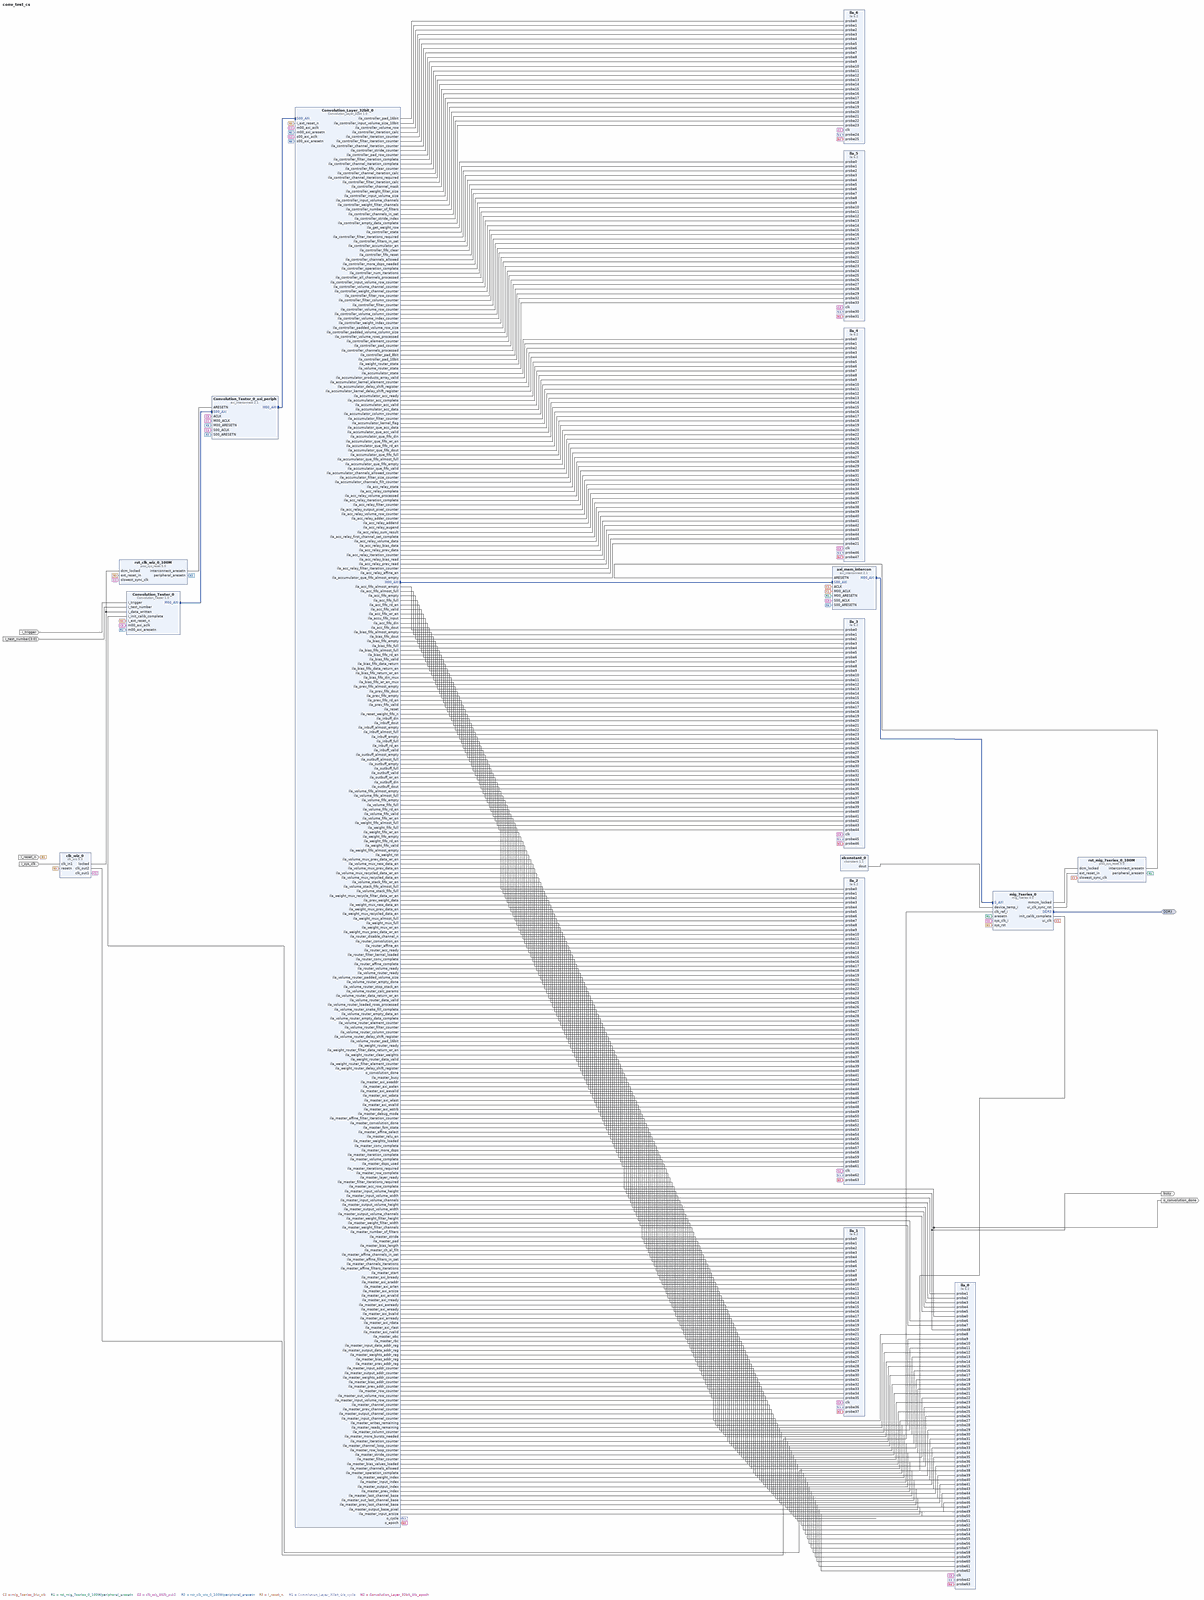
[diagram p0: block diagram of the top level, whole]
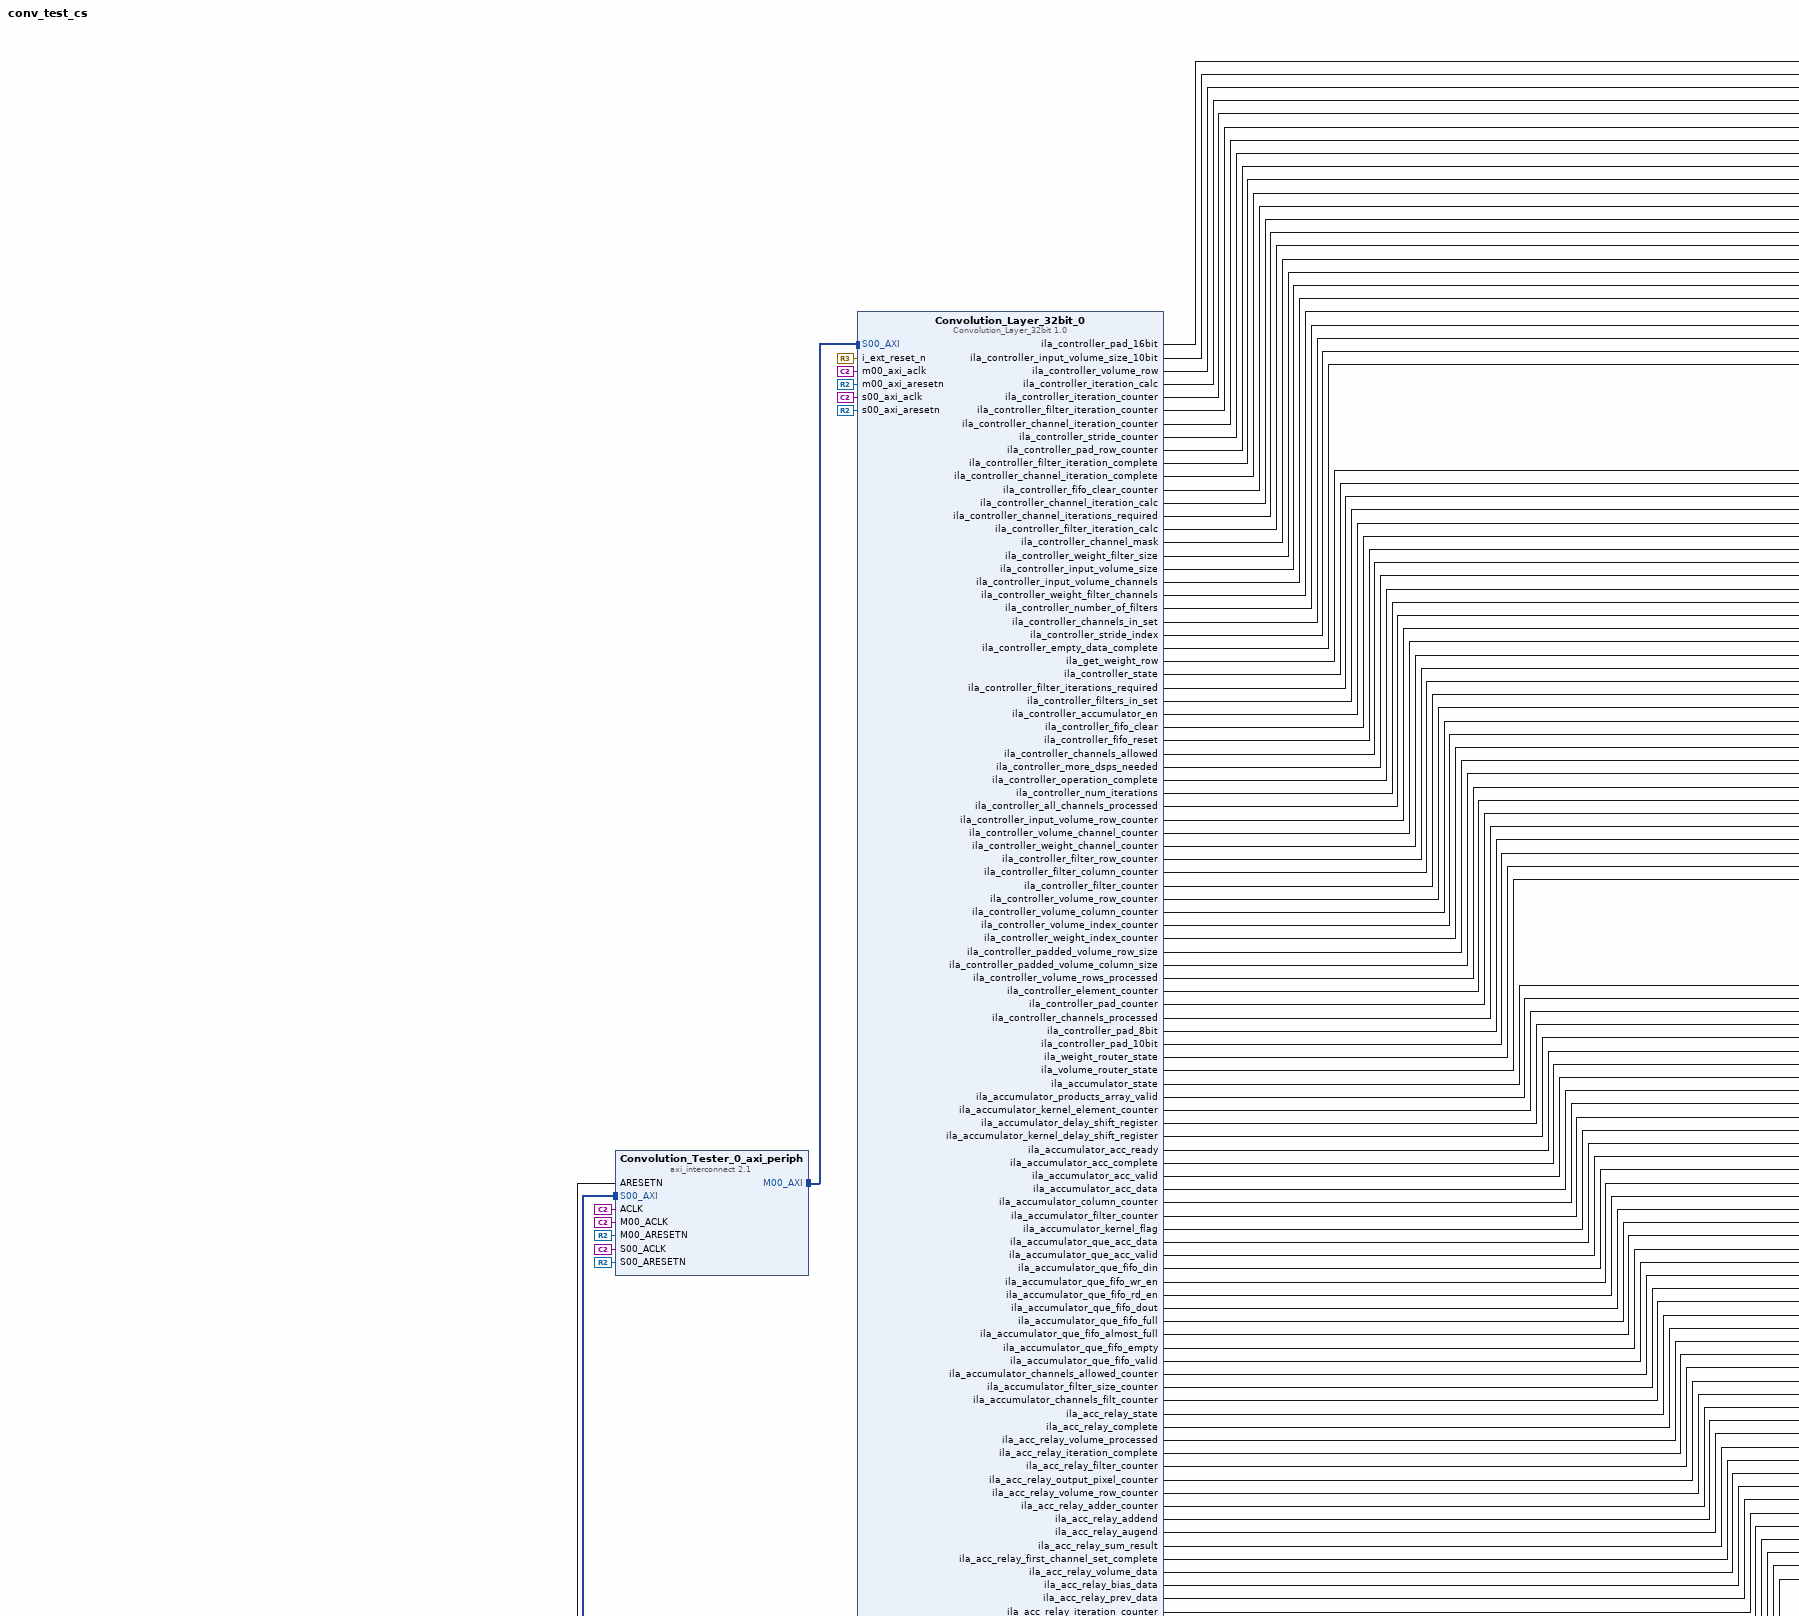
[diagram p1: block diagram of the top level, upper left part]
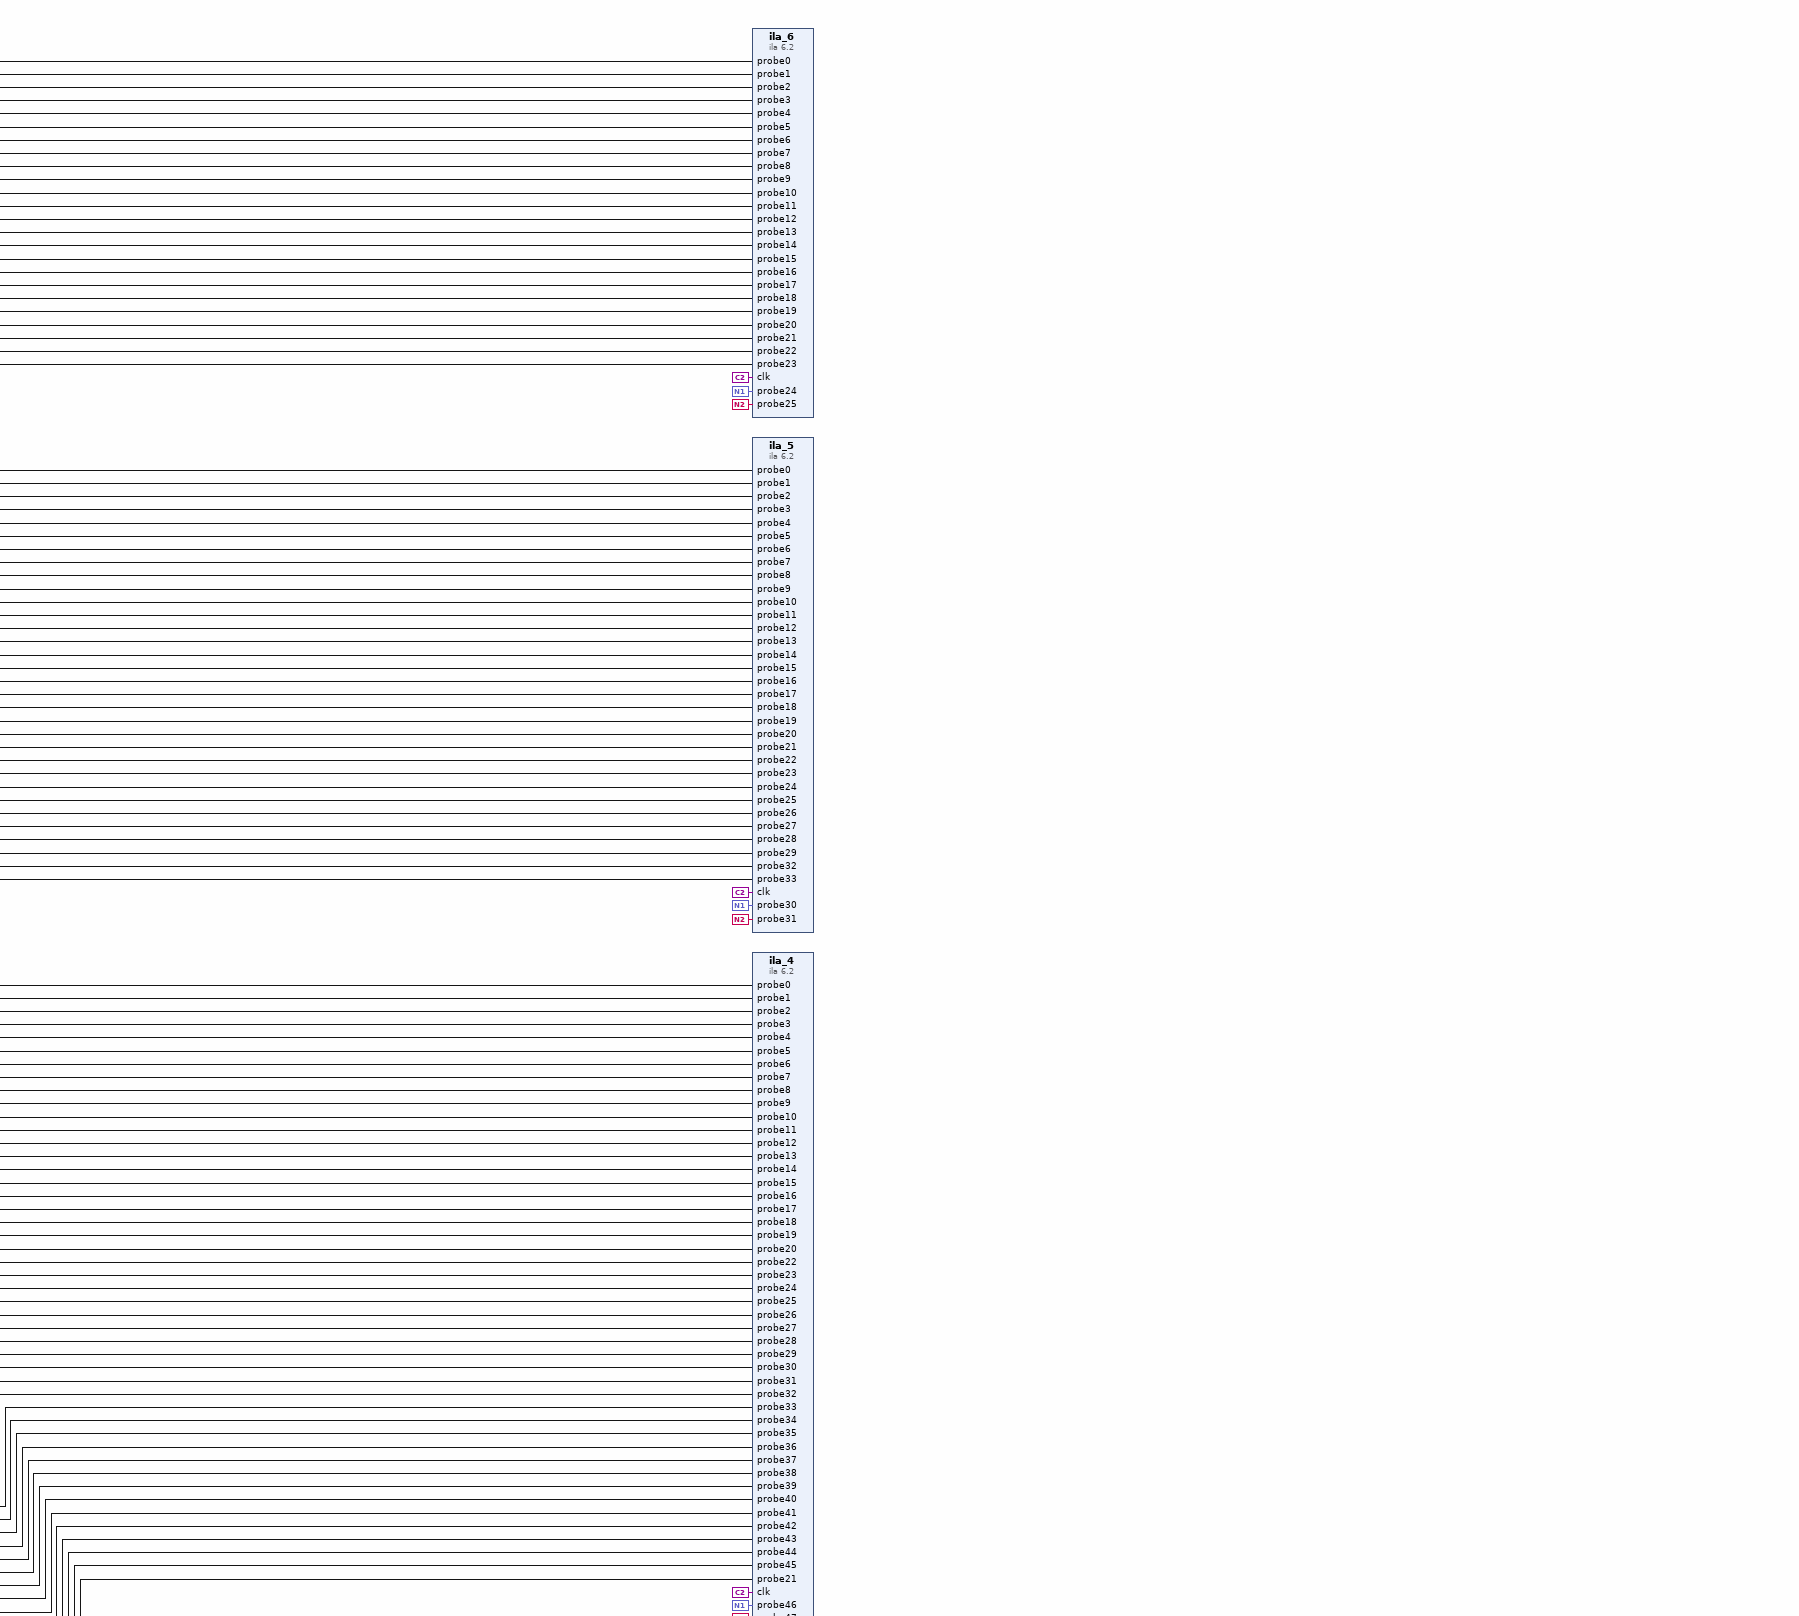
[diagram p2: block diagram of the top level, upper right part]
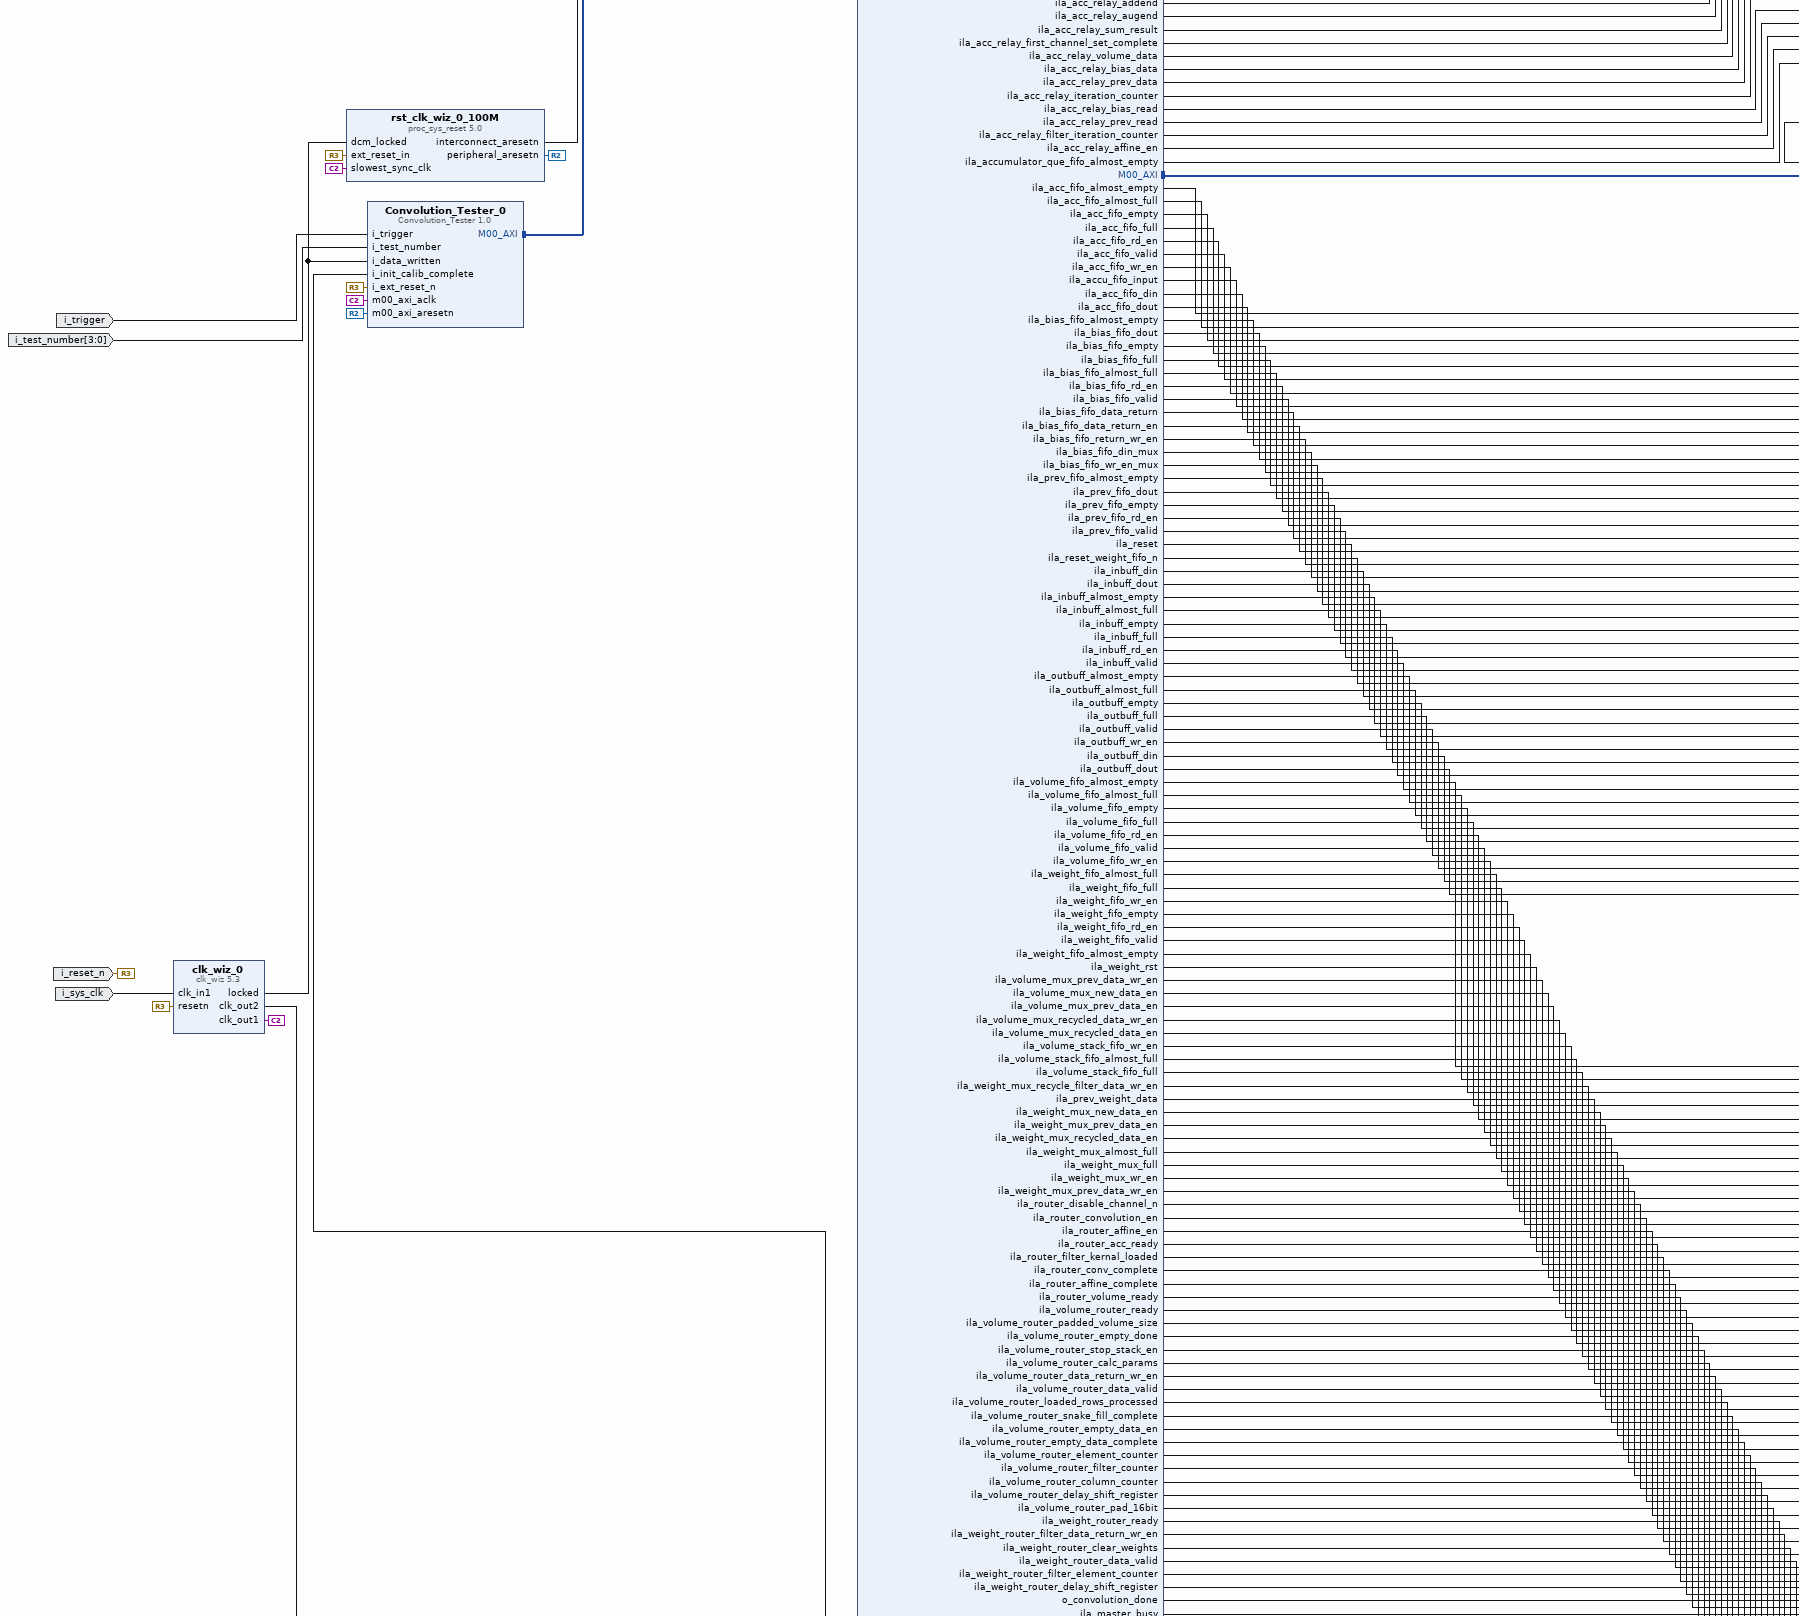
[diagram p3: block diagram of the top level, middle left part]
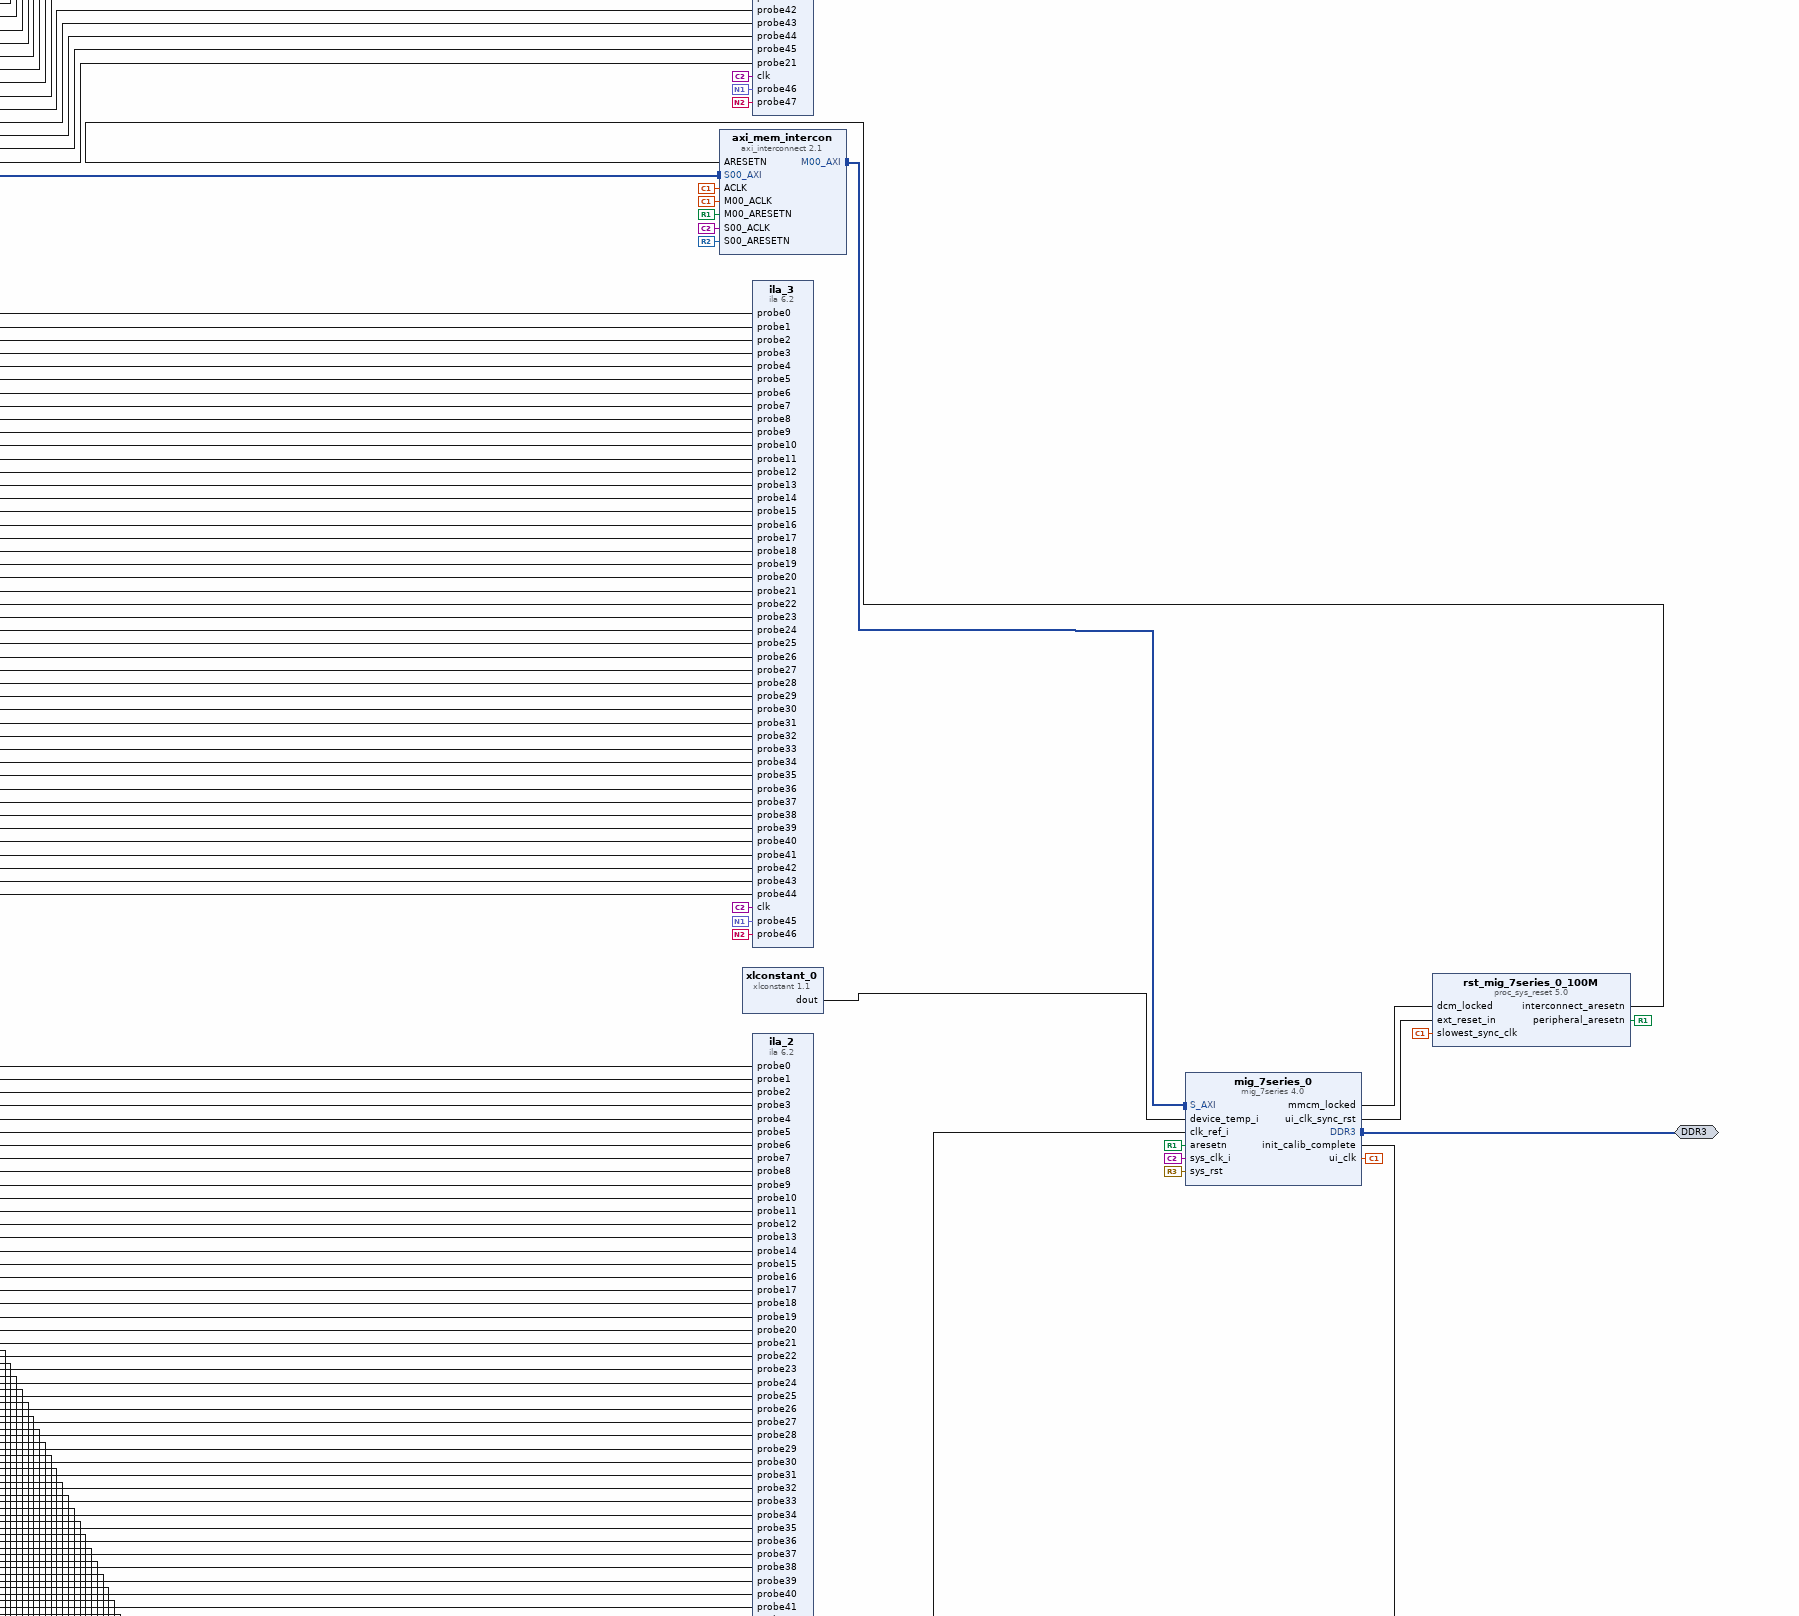
[diagram p4: block diagram of the top level, middle right part]
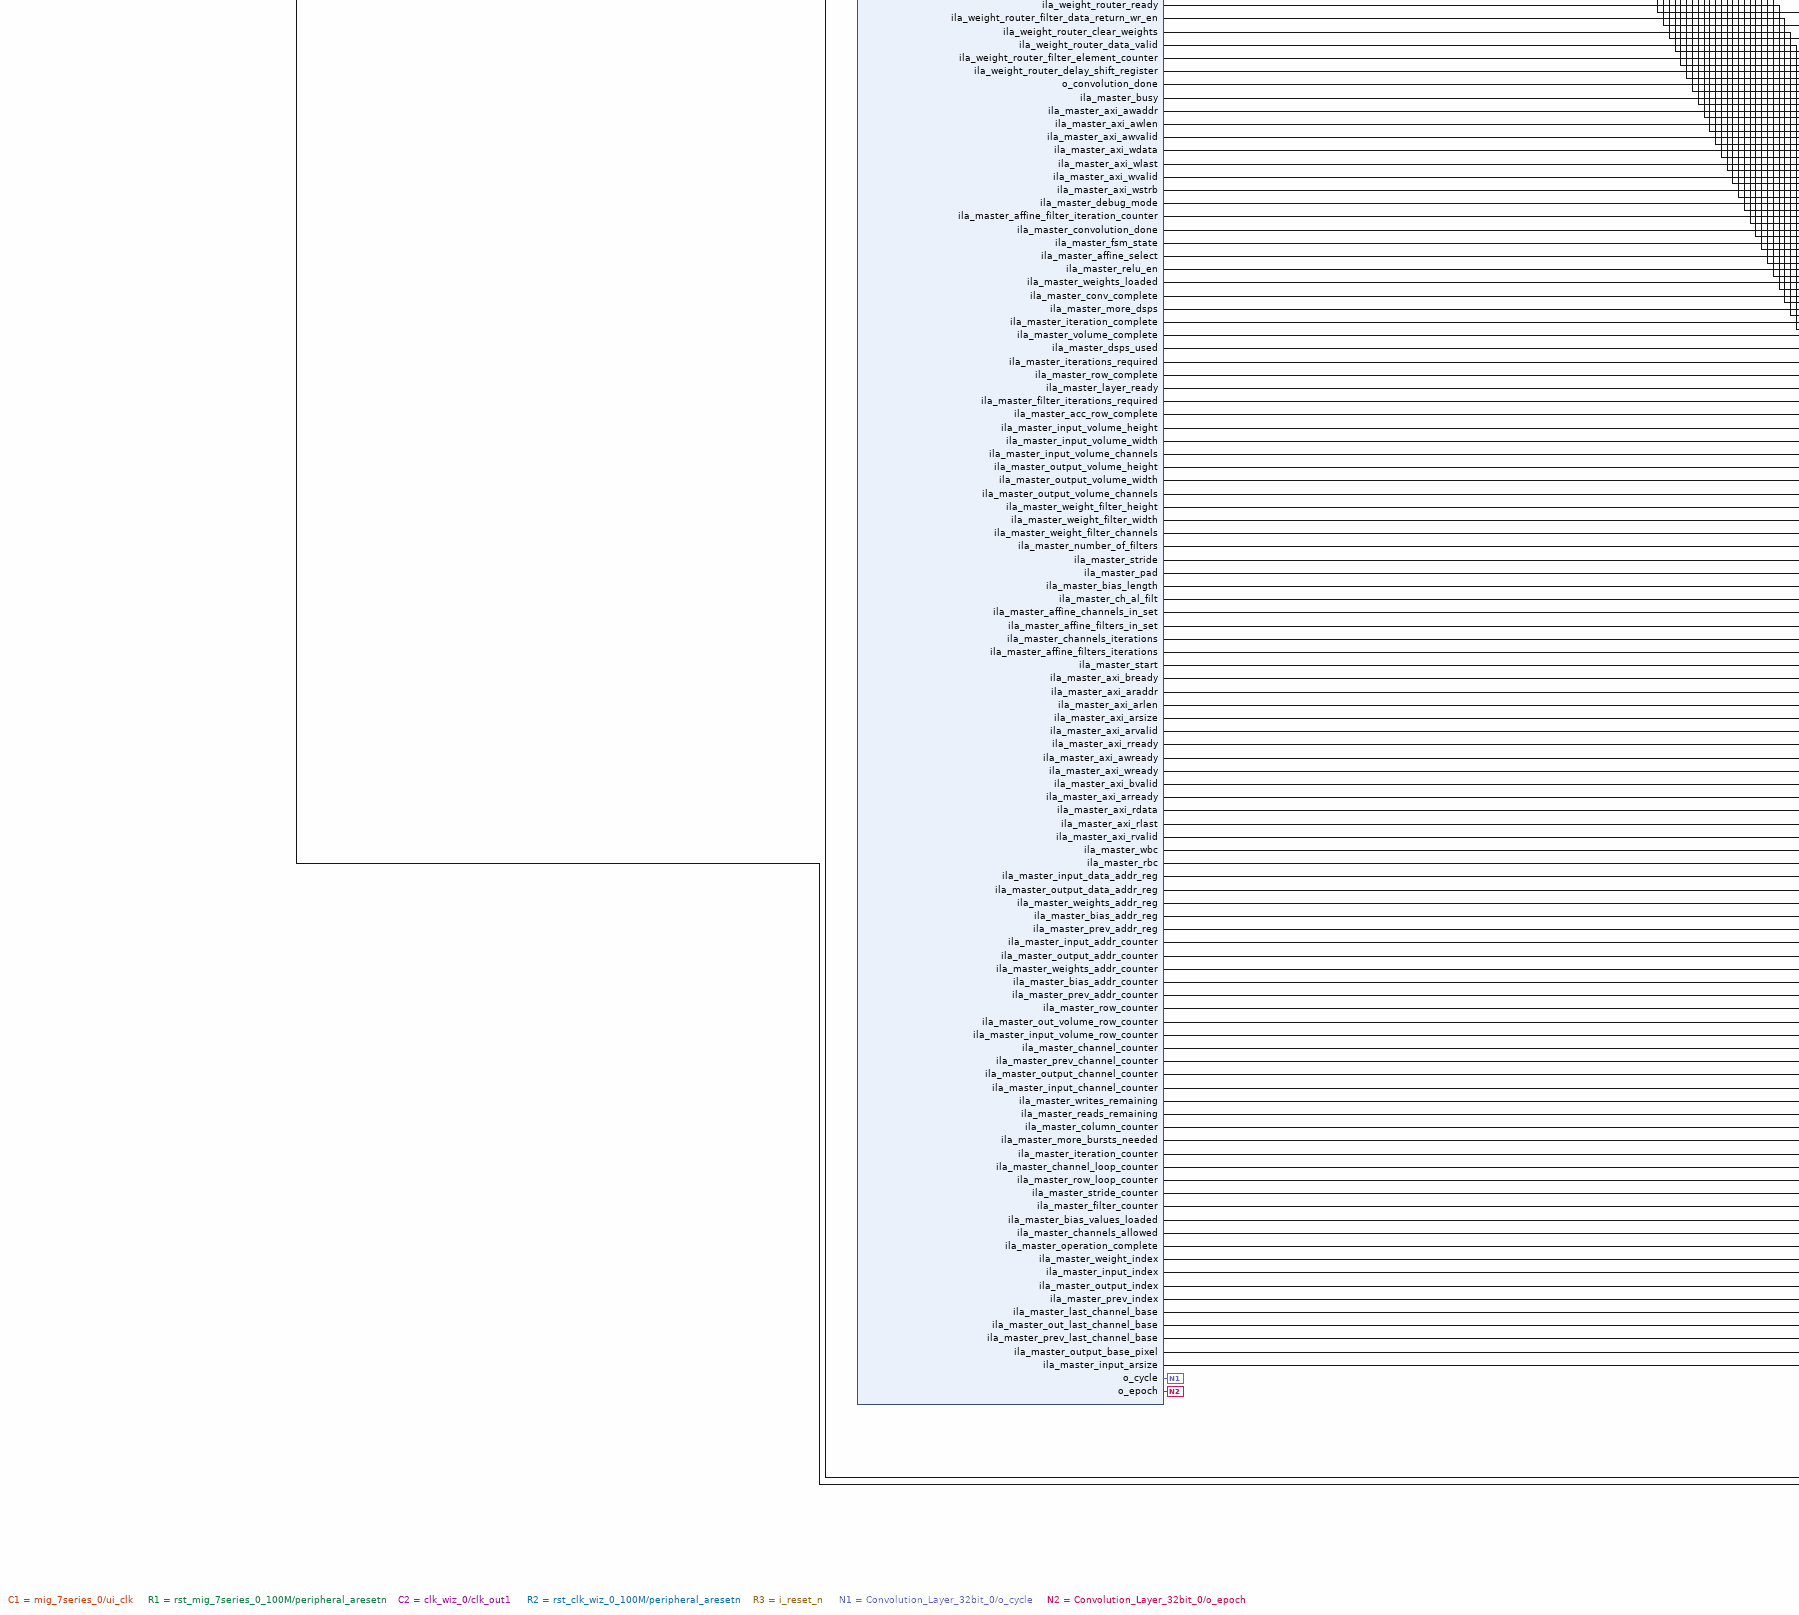
[diagram p5: block diagram of the top level, lower left part]
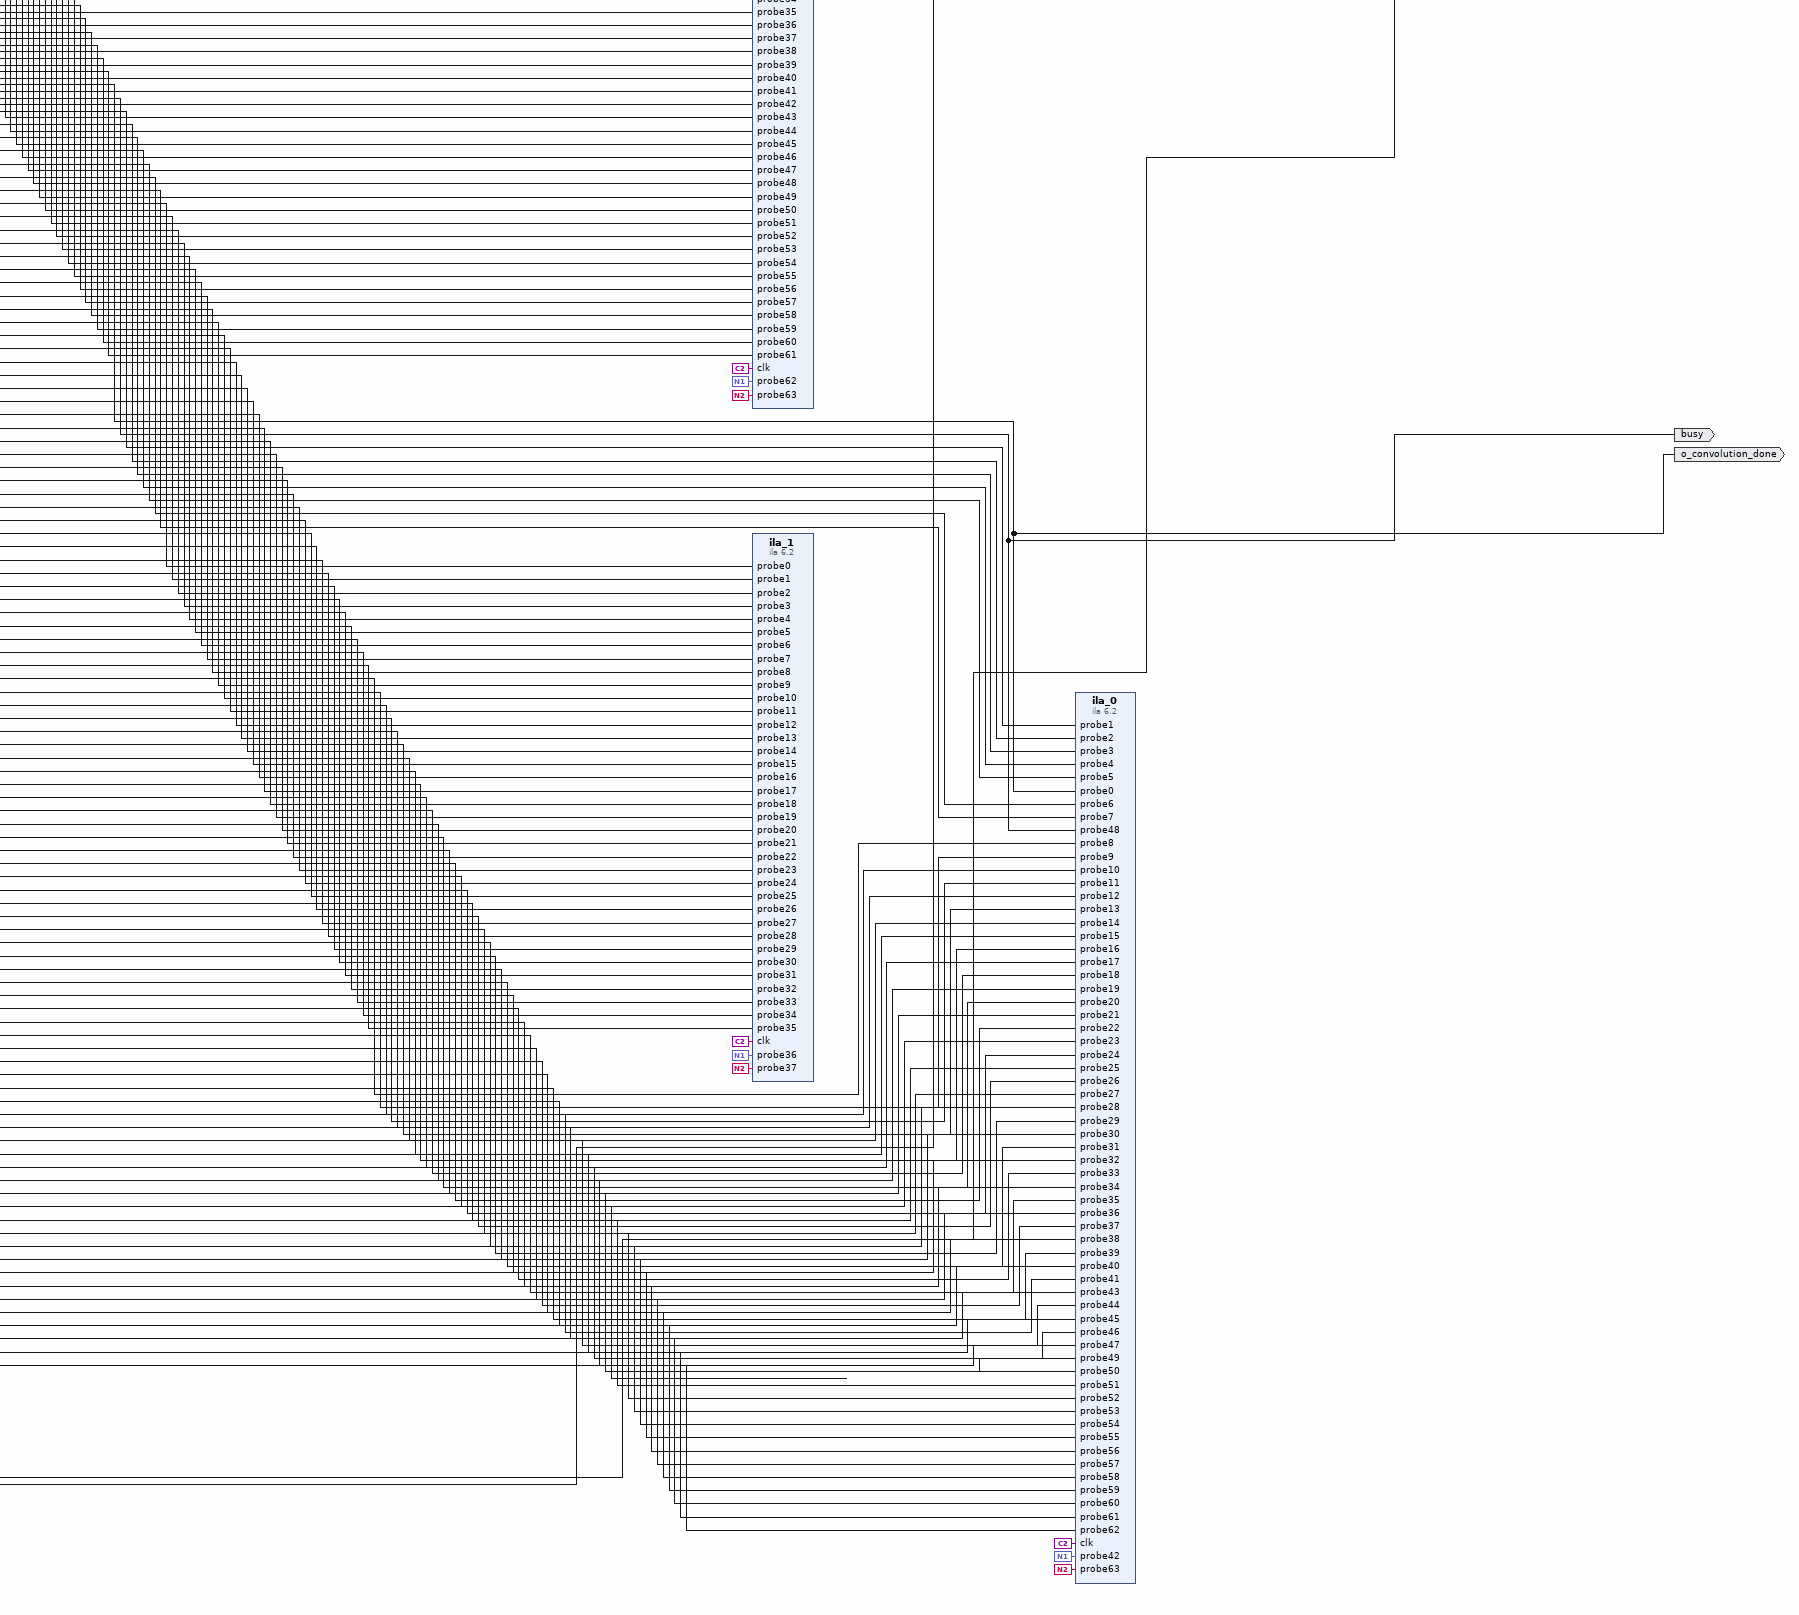
[diagram p6: block diagram of the top level, lower right part]
# Vivado block design conv_test_cs, xc7a200tsbg484-1, Vivado 2016.4
create_bd_design conv_test_cs

create_bd_intf_port -mode Master -vlnv xilinx.com:interface:ddrx_rtl:1.0 DDR3
create_bd_port -dir I -type clk i_sys_clk
set_property -dict {CONFIG.FREQ_HZ 100000000 CONFIG.PHASE 0.000} [get_bd_ports i_sys_clk]
create_bd_port -dir I -type rst i_reset_n
set_property -dict {CONFIG.POLARITY ACTIVE_LOW} [get_bd_ports i_reset_n]
create_bd_port -dir I i_trigger
create_bd_port -dir O o_convolution_done
create_bd_port -dir O busy
create_bd_port -dir I -from 3 -to 0 i_test_number

create_bd_cell -type ip -vlnv xilinx.com:ip:clk_wiz:5.3 clk_wiz_0
set_property -dict [list \
  CONFIG.CLKOUT2_USED true \
  CONFIG.NUM_OUT_CLKS 2 \
  CONFIG.CLKOUT2_REQUESTED_OUT_FREQ 200.000 \
  CONFIG.RESET_PORT resetn \
  CONFIG.MMCM_DIVCLK_DIVIDE 1 \
  CONFIG.MMCM_CLKOUT1_DIVIDE 5 \
  CONFIG.RESET_TYPE ACTIVE_LOW \
  CONFIG.CLKOUT2_JITTER 114.829 \
  CONFIG.CLKOUT2_PHASE_ERROR 98.575 \
] [get_bd_cells clk_wiz_0]
create_bd_cell -type ip -vlnv xilinx.com:ip:mig_7series:4.0 mig_7series_0
set_property -dict [list \
  CONFIG.XML_INPUT_FILE mig_b.prj \
  CONFIG.RESET_BOARD_INTERFACE Custom \
  CONFIG.MIG_DONT_TOUCH_PARAM Custom \
  CONFIG.BOARD_MIG_PARAM Custom \
] [get_bd_cells mig_7series_0]
create_bd_cell -type ip -vlnv xilinx.com:ip:axi_interconnect:2.1 axi_mem_intercon
set_property -dict {CONFIG.NUM_MI 1} [get_bd_cells axi_mem_intercon]
create_bd_cell -type ip -vlnv xilinx.com:ip:proc_sys_reset:5.0 rst_mig_7series_0_100M
create_bd_cell -type ip -vlnv xilinx.com:ip:axi_interconnect:2.1 Convolution_Tester_0_axi_periph
set_property -dict {CONFIG.NUM_MI 1} [get_bd_cells Convolution_Tester_0_axi_periph]
create_bd_cell -type ip -vlnv xilinx.com:ip:proc_sys_reset:5.0 rst_clk_wiz_0_100M
create_bd_cell -type ip -vlnv xilinx.com:ip:xlconstant:1.1 xlconstant_0
set_property -dict {CONFIG.CONST_WIDTH 12} [get_bd_cells xlconstant_0]
create_bd_cell -type ip -vlnv xilinx.com:ip:ila:6.2 ila_0
set_property -dict [list \
  CONFIG.C_PROBE63_WIDTH 64 \
  CONFIG.C_PROBE62_WIDTH 3 \
  CONFIG.C_PROBE61_WIDTH 32 \
  CONFIG.C_PROBE60_WIDTH 32 \
  CONFIG.C_PROBE59_WIDTH 32 \
  CONFIG.C_PROBE58_WIDTH 32 \
  CONFIG.C_PROBE57_WIDTH 32 \
  CONFIG.C_PROBE56_WIDTH 32 \
  CONFIG.C_PROBE55_WIDTH 32 \
  CONFIG.C_PROBE54_WIDTH 32 \
  CONFIG.C_PROBE52_WIDTH 16 \
  CONFIG.C_PROBE50_WIDTH 16 \
  CONFIG.C_PROBE49_WIDTH 4 \
  CONFIG.C_PROBE47_WIDTH 8 \
  CONFIG.C_PROBE46_WIDTH 16 \
  CONFIG.C_PROBE45_WIDTH 16 \
  CONFIG.C_PROBE43_WIDTH 8 \
  CONFIG.C_PROBE42_WIDTH 64 \
  CONFIG.C_PROBE41_WIDTH 32 \
  CONFIG.C_PROBE40_WIDTH 16 \
  CONFIG.C_PROBE39_WIDTH 16 \
  CONFIG.C_PROBE38_WIDTH 16 \
  CONFIG.C_PROBE37_WIDTH 16 \
  CONFIG.C_PROBE36_WIDTH 16 \
  CONFIG.C_PROBE35_WIDTH 8 \
  CONFIG.C_PROBE34_WIDTH 8 \
  CONFIG.C_PROBE33_WIDTH 8 \
  CONFIG.C_PROBE32_WIDTH 32 \
  CONFIG.C_PROBE31_WIDTH 32 \
  CONFIG.C_PROBE30_WIDTH 32 \
  CONFIG.C_PROBE29_WIDTH 32 \
  CONFIG.C_PROBE28_WIDTH 32 \
  CONFIG.C_PROBE27_WIDTH 32 \
  CONFIG.C_PROBE26_WIDTH 32 \
  CONFIG.C_PROBE25_WIDTH 32 \
  CONFIG.C_PROBE24_WIDTH 32 \
  CONFIG.C_PROBE23_WIDTH 32 \
  CONFIG.C_PROBE22_WIDTH 8 \
  CONFIG.C_PROBE21_WIDTH 8 \
  CONFIG.C_PROBE18_WIDTH 32 \
  CONFIG.C_PROBE11_WIDTH 3 \
  CONFIG.C_PROBE10_WIDTH 8 \
  CONFIG.C_PROBE9_WIDTH 32 \
  CONFIG.C_PROBE7_WIDTH 4 \
  CONFIG.C_PROBE4_WIDTH 32 \
  CONFIG.C_PROBE2_WIDTH 8 \
  CONFIG.C_PROBE1_WIDTH 32 \
  CONFIG.C_NUM_OF_PROBES 64 \
  CONFIG.C_ENABLE_ILA_AXI_MON false \
  CONFIG.C_MONITOR_TYPE Native \
] [get_bd_cells ila_0]
create_bd_cell -type ip -vlnv xilinx.com:ip:ila:6.2 ila_1
set_property -dict [list \
  CONFIG.C_PROBE37_WIDTH 64 \
  CONFIG.C_PROBE36_WIDTH 64 \
  CONFIG.C_PROBE34_WIDTH 16 \
  CONFIG.C_PROBE33_WIDTH 16 \
  CONFIG.C_PROBE32_WIDTH 16 \
  CONFIG.C_PROBE31_WIDTH 16 \
  CONFIG.C_PROBE30_WIDTH 16 \
  CONFIG.C_PROBE29_WIDTH 16 \
  CONFIG.C_PROBE28_WIDTH 4 \
  CONFIG.C_PROBE27_WIDTH 4 \
  CONFIG.C_PROBE26_WIDTH 16 \
  CONFIG.C_PROBE25_WIDTH 16 \
  CONFIG.C_PROBE24_WIDTH 4 \
  CONFIG.C_PROBE23_WIDTH 4 \
  CONFIG.C_PROBE22_WIDTH 12 \
  CONFIG.C_PROBE21_WIDTH 8 \
  CONFIG.C_PROBE20_WIDTH 8 \
  CONFIG.C_PROBE19_WIDTH 12 \
  CONFIG.C_PROBE18_WIDTH 8 \
  CONFIG.C_PROBE17_WIDTH 8 \
  CONFIG.C_PROBE15_WIDTH 16 \
  CONFIG.C_PROBE12_WIDTH 8 \
  CONFIG.C_PROBE11_WIDTH 8 \
  CONFIG.C_PROBE3_WIDTH 5 \
  CONFIG.C_PROBE1_WIDTH 16 \
  CONFIG.C_NUM_OF_PROBES 38 \
  CONFIG.C_ENABLE_ILA_AXI_MON false \
  CONFIG.C_MONITOR_TYPE Native \
] [get_bd_cells ila_1]
create_bd_cell -type ip -vlnv xilinx.com:ip:ila:6.2 ila_2
set_property -dict [list \
  CONFIG.C_PROBE63_WIDTH 64 \
  CONFIG.C_PROBE62_WIDTH 64 \
  CONFIG.C_PROBE61_WIDTH 8 \
  CONFIG.C_PROBE60_WIDTH 4 \
  CONFIG.C_PROBE59_WIDTH 33 \
  CONFIG.C_PROBE58_WIDTH 1 \
  CONFIG.C_PROBE57_WIDTH 33 \
  CONFIG.C_PROBE56_WIDTH 33 \
  CONFIG.C_PROBE55_WIDTH 16 \
  CONFIG.C_PROBE54_WIDTH 8 \
  CONFIG.C_PROBE53_WIDTH 8 \
  CONFIG.C_PROBE52_WIDTH 16 \
  CONFIG.C_PROBE51_WIDTH 10 \
  CONFIG.C_PROBE50_WIDTH 33 \
  CONFIG.C_PROBE49_WIDTH 33 \
  CONFIG.C_PROBE48_WIDTH 33 \
  CONFIG.C_PROBE47_WIDTH 33 \
  CONFIG.C_PROBE46_WIDTH 33 \
  CONFIG.C_PROBE45_WIDTH 33 \
  CONFIG.C_PROBE43_WIDTH 33 \
  CONFIG.C_PROBE41_WIDTH 16 \
  CONFIG.C_PROBE40_WIDTH 33 \
  CONFIG.C_PROBE39_WIDTH 33 \
  CONFIG.C_PROBE38_WIDTH 33 \
  CONFIG.C_PROBE37_WIDTH 33 \
  CONFIG.C_PROBE36_WIDTH 33 \
  CONFIG.C_PROBE32_WIDTH 33 \
  CONFIG.C_PROBE31_WIDTH 33 \
  CONFIG.C_PROBE30_WIDTH 33 \
  CONFIG.C_PROBE29_WIDTH 33 \
  CONFIG.C_PROBE28_WIDTH 33 \
  CONFIG.C_PROBE27_WIDTH 33 \
  CONFIG.C_PROBE26_WIDTH 33 \
  CONFIG.C_PROBE25_WIDTH 33 \
  CONFIG.C_PROBE24_WIDTH 32 \
  CONFIG.C_PROBE23_WIDTH 33 \
  CONFIG.C_PROBE22_WIDTH 33 \
  CONFIG.C_PROBE21_WIDTH 33 \
  CONFIG.C_PROBE20_WIDTH 33 \
  CONFIG.C_PROBE19_WIDTH 33 \
  CONFIG.C_PROBE18_WIDTH 33 \
  CONFIG.C_PROBE17_WIDTH 33 \
  CONFIG.C_PROBE16_WIDTH 33 \
  CONFIG.C_PROBE15_WIDTH 33 \
  CONFIG.C_PROBE13_WIDTH 33 \
  CONFIG.C_PROBE12_WIDTH 33 \
  CONFIG.C_PROBE11_WIDTH 33 \
  CONFIG.C_PROBE10_WIDTH 33 \
  CONFIG.C_PROBE9_WIDTH 33 \
  CONFIG.C_PROBE8_WIDTH 33 \
  CONFIG.C_PROBE7_WIDTH 33 \
  CONFIG.C_PROBE6_WIDTH 33 \
  CONFIG.C_PROBE5_WIDTH 33 \
  CONFIG.C_PROBE4_WIDTH 33 \
  CONFIG.C_PROBE3_WIDTH 33 \
  CONFIG.C_PROBE2_WIDTH 33 \
  CONFIG.C_PROBE1_WIDTH 33 \
  CONFIG.C_PROBE0_WIDTH 33 \
  CONFIG.C_NUM_OF_PROBES 64 \
  CONFIG.C_ENABLE_ILA_AXI_MON false \
  CONFIG.C_MONITOR_TYPE Native \
] [get_bd_cells ila_2]
create_bd_cell -type ip -vlnv xilinx.com:ip:ila:6.2 ila_3
set_property -dict [list \
  CONFIG.C_PROBE46_WIDTH 64 \
  CONFIG.C_PROBE45_WIDTH 64 \
  CONFIG.C_PROBE44_WIDTH 32 \
  CONFIG.C_PROBE43_WIDTH 32 \
  CONFIG.C_PROBE30_WIDTH 32 \
  CONFIG.C_PROBE29_WIDTH 32 \
  CONFIG.C_PROBE23_WIDTH 32 \
  CONFIG.C_PROBE20_WIDTH 32 \
  CONFIG.C_PROBE17_WIDTH 32 \
  CONFIG.C_PROBE11_WIDTH 32 \
  CONFIG.C_PROBE9_WIDTH 32 \
  CONFIG.C_PROBE8_WIDTH 32 \
  CONFIG.C_PROBE7_WIDTH 32 \
  CONFIG.C_NUM_OF_PROBES 47 \
  CONFIG.C_ENABLE_ILA_AXI_MON false \
  CONFIG.C_MONITOR_TYPE Native \
] [get_bd_cells ila_3]
create_bd_cell -type ip -vlnv xilinx.com:ip:ila:6.2 ila_4
set_property -dict [list \
  CONFIG.C_PROBE47_WIDTH 64 \
  CONFIG.C_PROBE46_WIDTH 64 \
  CONFIG.C_PROBE44_WIDTH 16 \
  CONFIG.C_PROBE41_WIDTH 8 \
  CONFIG.C_PROBE40_WIDTH 32 \
  CONFIG.C_PROBE39_WIDTH 32 \
  CONFIG.C_PROBE38_WIDTH 32 \
  CONFIG.C_PROBE36_WIDTH 32 \
  CONFIG.C_PROBE35_WIDTH 32 \
  CONFIG.C_PROBE34_WIDTH 32 \
  CONFIG.C_PROBE33_WIDTH 8 \
  CONFIG.C_PROBE32_WIDTH 8 \
  CONFIG.C_PROBE31_WIDTH 8 \
  CONFIG.C_PROBE30_WIDTH 16 \
  CONFIG.C_PROBE26_WIDTH 4 \
  CONFIG.C_PROBE25_WIDTH 16 \
  CONFIG.C_PROBE24_WIDTH 32 \
  CONFIG.C_PROBE23_WIDTH 32 \
  CONFIG.C_PROBE17_WIDTH 32 \
  CONFIG.C_PROBE14_WIDTH 32 \
  CONFIG.C_PROBE12_WIDTH 32 \
  CONFIG.C_PROBE10_WIDTH 32 \
  CONFIG.C_PROBE9_WIDTH 32 \
  CONFIG.C_PROBE8_WIDTH 32 \
  CONFIG.C_PROBE4_WIDTH 51 \
  CONFIG.C_PROBE3_WIDTH 78 \
  CONFIG.C_PROBE2_WIDTH 16 \
  CONFIG.C_PROBE1_WIDTH 33 \
  CONFIG.C_PROBE0_WIDTH 4 \
  CONFIG.C_NUM_OF_PROBES 48 \
  CONFIG.C_ENABLE_ILA_AXI_MON false \
  CONFIG.C_MONITOR_TYPE Native \
] [get_bd_cells ila_4]
create_bd_cell -type ip -vlnv xilinx.com:ip:ila:6.2 ila_5
set_property -dict [list \
  CONFIG.C_PROBE33_WIDTH 4 \
  CONFIG.C_PROBE32_WIDTH 4 \
  CONFIG.C_PROBE31_WIDTH 64 \
  CONFIG.C_PROBE30_WIDTH 64 \
  CONFIG.C_PROBE29_WIDTH 10 \
  CONFIG.C_PROBE28_WIDTH 8 \
  CONFIG.C_PROBE27_WIDTH 16 \
  CONFIG.C_PROBE26_WIDTH 4 \
  CONFIG.C_PROBE25_WIDTH 16 \
  CONFIG.C_PROBE24_WIDTH 16 \
  CONFIG.C_PROBE23_WIDTH 16 \
  CONFIG.C_PROBE22_WIDTH 16 \
  CONFIG.C_PROBE21_WIDTH 16 \
  CONFIG.C_PROBE20_WIDTH 16 \
  CONFIG.C_PROBE19_WIDTH 16 \
  CONFIG.C_PROBE18_WIDTH 16 \
  CONFIG.C_PROBE17_WIDTH 16 \
  CONFIG.C_PROBE16_WIDTH 16 \
  CONFIG.C_PROBE15_WIDTH 16 \
  CONFIG.C_PROBE14_WIDTH 16 \
  CONFIG.C_PROBE13_WIDTH 16 \
  CONFIG.C_PROBE12_WIDTH 16 \
  CONFIG.C_PROBE10_WIDTH 8 \
  CONFIG.C_PROBE7_WIDTH 8 \
  CONFIG.C_PROBE3_WIDTH 16 \
  CONFIG.C_PROBE2_WIDTH 16 \
  CONFIG.C_PROBE1_WIDTH 5 \
  CONFIG.C_PROBE0_WIDTH 33 \
  CONFIG.C_NUM_OF_PROBES 34 \
  CONFIG.C_ENABLE_ILA_AXI_MON false \
  CONFIG.C_MONITOR_TYPE Native \
] [get_bd_cells ila_5]
create_bd_cell -type ip -vlnv xilinx.com:ip:ila:6.2 ila_6
set_property -dict [list \
  CONFIG.C_PROBE25_WIDTH 64 \
  CONFIG.C_PROBE24_WIDTH 64 \
  CONFIG.C_PROBE23_WIDTH 33 \
  CONFIG.C_PROBE22_WIDTH 16 \
  CONFIG.C_PROBE21_WIDTH 8 \
  CONFIG.C_PROBE20_WIDTH 16 \
  CONFIG.C_PROBE19_WIDTH 16 \
  CONFIG.C_PROBE18_WIDTH 16 \
  CONFIG.C_PROBE17_WIDTH 16 \
  CONFIG.C_PROBE16_WIDTH 16 \
  CONFIG.C_PROBE15_WIDTH 33 \
  CONFIG.C_PROBE14_WIDTH 16 \
  CONFIG.C_PROBE13_WIDTH 16 \
  CONFIG.C_PROBE12_WIDTH 16 \
  CONFIG.C_PROBE11_WIDTH 8 \
  CONFIG.C_PROBE8_WIDTH 4 \
  CONFIG.C_PROBE7_WIDTH 4 \
  CONFIG.C_PROBE6_WIDTH 16 \
  CONFIG.C_PROBE5_WIDTH 16 \
  CONFIG.C_PROBE4_WIDTH 16 \
  CONFIG.C_PROBE3_WIDTH 16 \
  CONFIG.C_PROBE2_WIDTH 16 \
  CONFIG.C_PROBE1_WIDTH 10 \
  CONFIG.C_PROBE0_WIDTH 16 \
  CONFIG.C_NUM_OF_PROBES 26 \
  CONFIG.C_ENABLE_ILA_AXI_MON false \
  CONFIG.C_MONITOR_TYPE Native \
] [get_bd_cells ila_6]
create_bd_cell -type ip -vlnv xilinx.com:user:Convolution_Tester:1.0 Convolution_Tester_0
create_bd_cell -type ip -vlnv xilinx.com:user:Convolution_Layer_32bit:1.0 Convolution_Layer_32bit_0

# ---- connections ----

connect_bd_intf_net [get_bd_intf_pins Convolution_Layer_32bit_0/M00_AXI] [get_bd_intf_pins axi_mem_intercon/S00_AXI]
connect_bd_intf_net [get_bd_intf_pins axi_mem_intercon/M00_AXI] [get_bd_intf_pins mig_7series_0/S_AXI]
connect_bd_intf_net [get_bd_intf_pins Convolution_Tester_0/M00_AXI] [get_bd_intf_pins Convolution_Tester_0_axi_periph/S00_AXI]
connect_bd_intf_net [get_bd_intf_pins Convolution_Tester_0_axi_periph/M00_AXI] [get_bd_intf_pins Convolution_Layer_32bit_0/S00_AXI]
connect_bd_intf_net [get_bd_intf_ports DDR3] [get_bd_intf_pins mig_7series_0/DDR3]
connect_bd_net [get_bd_pins mig_7series_0/ui_clk] \
  [get_bd_pins rst_mig_7series_0_100M/slowest_sync_clk] [get_bd_pins axi_mem_intercon/ACLK] \
  [get_bd_pins axi_mem_intercon/M00_ACLK]
connect_bd_net [get_bd_pins mig_7series_0/mmcm_locked] [get_bd_pins rst_mig_7series_0_100M/dcm_locked]
connect_bd_net [get_bd_pins mig_7series_0/ui_clk_sync_rst] [get_bd_pins rst_mig_7series_0_100M/ext_reset_in]
connect_bd_net [get_bd_pins rst_mig_7series_0_100M/peripheral_aresetn] [get_bd_pins mig_7series_0/aresetn] [get_bd_pins axi_mem_intercon/M00_ARESETN]
connect_bd_net [get_bd_pins rst_mig_7series_0_100M/interconnect_aresetn] [get_bd_pins axi_mem_intercon/ARESETN]
connect_bd_net [get_bd_pins clk_wiz_0/clk_out1] \
  [get_bd_pins rst_clk_wiz_0_100M/slowest_sync_clk] [get_bd_pins mig_7series_0/sys_clk_i] [get_bd_pins ila_0/clk] \
  [get_bd_pins ila_2/clk] [get_bd_pins ila_4/clk] [get_bd_pins ila_3/clk] [get_bd_pins ila_5/clk] [get_bd_pins ila_6/clk] \
  [get_bd_pins ila_1/clk] [get_bd_pins Convolution_Tester_0/m00_axi_aclk] \
  [get_bd_pins Convolution_Tester_0_axi_periph/S00_ACLK] [get_bd_pins Convolution_Tester_0_axi_periph/ACLK] \
  [get_bd_pins Convolution_Tester_0_axi_periph/M00_ACLK] [get_bd_pins axi_mem_intercon/S00_ACLK] \
  [get_bd_pins Convolution_Layer_32bit_0/m00_axi_aclk] [get_bd_pins Convolution_Layer_32bit_0/s00_axi_aclk]
connect_bd_net [get_bd_pins clk_wiz_0/locked] [get_bd_pins rst_clk_wiz_0_100M/dcm_locked] [get_bd_pins Convolution_Tester_0/i_data_written]
connect_bd_net [get_bd_pins rst_clk_wiz_0_100M/peripheral_aresetn] \
  [get_bd_pins Convolution_Tester_0/m00_axi_aresetn] [get_bd_pins Convolution_Tester_0_axi_periph/S00_ARESETN] \
  [get_bd_pins Convolution_Tester_0_axi_periph/M00_ARESETN] [get_bd_pins axi_mem_intercon/S00_ARESETN] \
  [get_bd_pins Convolution_Layer_32bit_0/m00_axi_aresetn] [get_bd_pins Convolution_Layer_32bit_0/s00_axi_aresetn]
connect_bd_net [get_bd_pins rst_clk_wiz_0_100M/interconnect_aresetn] [get_bd_pins Convolution_Tester_0_axi_periph/ARESETN]
connect_bd_net -net clock_rtl_1 [get_bd_ports i_sys_clk] [get_bd_pins clk_wiz_0/clk_in1]
connect_bd_net -net reset_rtl_0_1_1 [get_bd_ports i_reset_n] \
  [get_bd_pins rst_clk_wiz_0_100M/ext_reset_in] [get_bd_pins clk_wiz_0/resetn] [get_bd_pins mig_7series_0/sys_rst] \
  [get_bd_pins Convolution_Tester_0/i_ext_reset_n] [get_bd_pins Convolution_Layer_32bit_0/i_ext_reset_n]
connect_bd_net [get_bd_pins clk_wiz_0/clk_out2] [get_bd_pins mig_7series_0/clk_ref_i]
connect_bd_net [get_bd_pins xlconstant_0/dout] [get_bd_pins mig_7series_0/device_temp_i]
connect_bd_net [get_bd_pins mig_7series_0/init_calib_complete] [get_bd_pins Convolution_Tester_0/i_init_calib_complete]
connect_bd_net [get_bd_ports i_trigger] [get_bd_pins Convolution_Tester_0/i_trigger]
connect_bd_net [get_bd_pins Convolution_Layer_32bit_0/o_convolution_done] [get_bd_ports o_convolution_done] [get_bd_pins ila_0/probe0]
connect_bd_net [get_bd_pins Convolution_Layer_32bit_0/ila_master_busy] [get_bd_ports busy] [get_bd_pins ila_0/probe48]
connect_bd_net [get_bd_pins Convolution_Layer_32bit_0/ila_master_axi_awaddr] [get_bd_pins ila_0/probe1]
connect_bd_net [get_bd_pins Convolution_Layer_32bit_0/ila_master_axi_awlen] [get_bd_pins ila_0/probe2]
connect_bd_net [get_bd_pins Convolution_Layer_32bit_0/ila_master_axi_awvalid] [get_bd_pins ila_0/probe3]
connect_bd_net [get_bd_pins Convolution_Layer_32bit_0/ila_master_axi_wdata] [get_bd_pins ila_0/probe4]
connect_bd_net [get_bd_pins Convolution_Layer_32bit_0/ila_master_axi_wlast] [get_bd_pins ila_0/probe5]
connect_bd_net [get_bd_pins Convolution_Layer_32bit_0/ila_master_axi_wvalid] [get_bd_pins ila_0/probe6]
connect_bd_net [get_bd_pins Convolution_Layer_32bit_0/ila_master_axi_wstrb] [get_bd_pins ila_0/probe7]
connect_bd_net [get_bd_pins Convolution_Layer_32bit_0/ila_master_axi_bready] [get_bd_pins ila_0/probe8]
connect_bd_net [get_bd_pins Convolution_Layer_32bit_0/ila_master_axi_araddr] [get_bd_pins ila_0/probe9]
connect_bd_net [get_bd_pins Convolution_Layer_32bit_0/ila_master_axi_arlen] [get_bd_pins ila_0/probe10]
connect_bd_net [get_bd_pins Convolution_Layer_32bit_0/ila_master_axi_arsize] [get_bd_pins ila_0/probe11]
connect_bd_net [get_bd_pins Convolution_Layer_32bit_0/ila_master_axi_arvalid] [get_bd_pins ila_0/probe12]
connect_bd_net [get_bd_pins Convolution_Layer_32bit_0/ila_master_axi_rready] [get_bd_pins ila_0/probe13]
connect_bd_net [get_bd_pins Convolution_Layer_32bit_0/ila_master_axi_awready] [get_bd_pins ila_0/probe14]
connect_bd_net [get_bd_pins Convolution_Layer_32bit_0/ila_master_axi_wready] [get_bd_pins ila_0/probe15]
connect_bd_net [get_bd_pins Convolution_Layer_32bit_0/ila_master_axi_bvalid] [get_bd_pins ila_0/probe16]
connect_bd_net [get_bd_pins Convolution_Layer_32bit_0/ila_master_axi_arready] [get_bd_pins ila_0/probe17]
connect_bd_net [get_bd_pins Convolution_Layer_32bit_0/ila_master_axi_rdata] [get_bd_pins ila_0/probe18]
connect_bd_net [get_bd_pins Convolution_Layer_32bit_0/ila_master_axi_rlast] [get_bd_pins ila_0/probe19]
connect_bd_net [get_bd_pins Convolution_Layer_32bit_0/ila_master_axi_rvalid] [get_bd_pins ila_0/probe20]
connect_bd_net [get_bd_pins Convolution_Layer_32bit_0/ila_master_wbc] [get_bd_pins ila_0/probe21]
connect_bd_net [get_bd_pins Convolution_Layer_32bit_0/ila_master_rbc] [get_bd_pins ila_0/probe22]
connect_bd_net [get_bd_pins Convolution_Layer_32bit_0/ila_master_input_data_addr_reg] [get_bd_pins ila_0/probe23]
connect_bd_net [get_bd_pins Convolution_Layer_32bit_0/ila_master_output_data_addr_reg] [get_bd_pins ila_0/probe24]
connect_bd_net [get_bd_pins Convolution_Layer_32bit_0/ila_master_weights_addr_reg] [get_bd_pins ila_0/probe25]
connect_bd_net [get_bd_pins Convolution_Layer_32bit_0/ila_master_bias_addr_reg] [get_bd_pins ila_0/probe26]
connect_bd_net [get_bd_pins Convolution_Layer_32bit_0/ila_master_prev_addr_reg] [get_bd_pins ila_0/probe27]
connect_bd_net [get_bd_pins Convolution_Layer_32bit_0/ila_master_input_addr_counter] [get_bd_pins ila_0/probe28]
connect_bd_net [get_bd_pins Convolution_Layer_32bit_0/ila_master_output_addr_counter] [get_bd_pins ila_0/probe29]
connect_bd_net [get_bd_pins Convolution_Layer_32bit_0/ila_master_weights_addr_counter] [get_bd_pins ila_0/probe30]
connect_bd_net [get_bd_pins Convolution_Layer_32bit_0/ila_master_bias_addr_counter] [get_bd_pins ila_0/probe31]
connect_bd_net [get_bd_pins Convolution_Layer_32bit_0/ila_master_prev_addr_counter] [get_bd_pins ila_0/probe32]
connect_bd_net [get_bd_pins Convolution_Layer_32bit_0/ila_master_row_counter] [get_bd_pins ila_0/probe33]
connect_bd_net [get_bd_pins Convolution_Layer_32bit_0/ila_master_out_volume_row_counter] [get_bd_pins ila_0/probe34]
connect_bd_net [get_bd_pins Convolution_Layer_32bit_0/ila_master_input_volume_row_counter] [get_bd_pins ila_0/probe35]
connect_bd_net [get_bd_pins Convolution_Layer_32bit_0/ila_master_channel_counter] [get_bd_pins ila_0/probe36]
connect_bd_net [get_bd_pins Convolution_Layer_32bit_0/ila_master_prev_channel_counter] [get_bd_pins ila_0/probe37]
connect_bd_net [get_bd_pins Convolution_Layer_32bit_0/ila_master_output_channel_counter] [get_bd_pins ila_0/probe38]
connect_bd_net [get_bd_pins Convolution_Layer_32bit_0/ila_master_input_channel_counter] [get_bd_pins ila_0/probe39]
connect_bd_net [get_bd_pins Convolution_Layer_32bit_0/ila_master_writes_remaining] [get_bd_pins ila_0/probe40]
connect_bd_net [get_bd_pins Convolution_Layer_32bit_0/ila_master_reads_remaining] [get_bd_pins ila_0/probe41]
connect_bd_net [get_bd_pins Convolution_Layer_32bit_0/ila_master_column_counter] [get_bd_pins ila_0/probe43]
connect_bd_net [get_bd_pins Convolution_Layer_32bit_0/ila_master_more_bursts_needed] [get_bd_pins ila_0/probe44]
connect_bd_net [get_bd_pins Convolution_Layer_32bit_0/ila_master_iteration_counter] [get_bd_pins ila_0/probe45]
connect_bd_net [get_bd_pins Convolution_Layer_32bit_0/ila_master_channel_loop_counter] [get_bd_pins ila_0/probe46]
connect_bd_net [get_bd_pins Convolution_Layer_32bit_0/ila_master_row_loop_counter] [get_bd_pins ila_0/probe47]
connect_bd_net [get_bd_pins Convolution_Layer_32bit_0/ila_master_stride_counter] [get_bd_pins ila_0/probe49]
connect_bd_net [get_bd_pins Convolution_Layer_32bit_0/ila_master_filter_counter] [get_bd_pins ila_0/probe50]
connect_bd_net [get_bd_pins Convolution_Layer_32bit_0/ila_master_bias_values_loaded] [get_bd_pins ila_0/probe51]
connect_bd_net [get_bd_pins Convolution_Layer_32bit_0/ila_master_channels_allowed] [get_bd_pins ila_0/probe52]
connect_bd_net [get_bd_pins Convolution_Layer_32bit_0/ila_master_operation_complete] [get_bd_pins ila_0/probe53]
connect_bd_net [get_bd_pins Convolution_Layer_32bit_0/ila_master_weight_index] [get_bd_pins ila_0/probe54]
connect_bd_net [get_bd_pins Convolution_Layer_32bit_0/ila_master_input_index] [get_bd_pins ila_0/probe55]
connect_bd_net [get_bd_pins Convolution_Layer_32bit_0/ila_master_output_index] [get_bd_pins ila_0/probe56]
connect_bd_net [get_bd_pins Convolution_Layer_32bit_0/ila_master_prev_index] [get_bd_pins ila_0/probe57]
connect_bd_net [get_bd_pins Convolution_Layer_32bit_0/ila_master_last_channel_base] [get_bd_pins ila_0/probe58]
connect_bd_net [get_bd_pins Convolution_Layer_32bit_0/ila_master_out_last_channel_base] [get_bd_pins ila_0/probe59]
connect_bd_net [get_bd_pins Convolution_Layer_32bit_0/ila_master_prev_last_channel_base] [get_bd_pins ila_0/probe60]
connect_bd_net [get_bd_pins Convolution_Layer_32bit_0/ila_master_output_base_pixel] [get_bd_pins ila_0/probe61]
connect_bd_net [get_bd_pins Convolution_Layer_32bit_0/ila_master_input_arsize] [get_bd_pins ila_0/probe62]
connect_bd_net [get_bd_pins Convolution_Layer_32bit_0/ila_master_debug_mode] [get_bd_pins ila_1/probe0]
connect_bd_net [get_bd_pins Convolution_Layer_32bit_0/ila_master_affine_filter_iteration_counter] [get_bd_pins ila_1/probe1]
connect_bd_net [get_bd_pins Convolution_Layer_32bit_0/ila_master_convolution_done] [get_bd_pins ila_1/probe2]
connect_bd_net [get_bd_pins Convolution_Layer_32bit_0/ila_master_fsm_state] [get_bd_pins ila_1/probe3]
connect_bd_net [get_bd_pins Convolution_Layer_32bit_0/ila_master_affine_select] [get_bd_pins ila_1/probe4]
connect_bd_net [get_bd_pins Convolution_Layer_32bit_0/ila_master_relu_en] [get_bd_pins ila_1/probe5]
connect_bd_net [get_bd_pins Convolution_Layer_32bit_0/ila_master_weights_loaded] [get_bd_pins ila_1/probe6]
connect_bd_net [get_bd_pins Convolution_Layer_32bit_0/ila_master_conv_complete] [get_bd_pins ila_1/probe7]
connect_bd_net [get_bd_pins Convolution_Layer_32bit_0/ila_master_more_dsps] [get_bd_pins ila_1/probe8]
connect_bd_net [get_bd_pins Convolution_Layer_32bit_0/ila_master_iteration_complete] [get_bd_pins ila_1/probe9]
connect_bd_net [get_bd_pins Convolution_Layer_32bit_0/ila_master_volume_complete] [get_bd_pins ila_1/probe10]
connect_bd_net [get_bd_pins Convolution_Layer_32bit_0/ila_master_dsps_used] [get_bd_pins ila_1/probe11]
connect_bd_net [get_bd_pins Convolution_Layer_32bit_0/ila_master_iterations_required] [get_bd_pins ila_1/probe12]
connect_bd_net [get_bd_pins Convolution_Layer_32bit_0/ila_master_row_complete] [get_bd_pins ila_1/probe13]
connect_bd_net [get_bd_pins Convolution_Layer_32bit_0/ila_master_layer_ready] [get_bd_pins ila_1/probe14]
connect_bd_net [get_bd_pins Convolution_Layer_32bit_0/ila_master_filter_iterations_required] [get_bd_pins ila_1/probe15]
connect_bd_net [get_bd_pins Convolution_Layer_32bit_0/ila_master_acc_row_complete] [get_bd_pins ila_1/probe16]
connect_bd_net [get_bd_pins Convolution_Layer_32bit_0/ila_master_input_volume_height] [get_bd_pins ila_1/probe17]
connect_bd_net [get_bd_pins Convolution_Layer_32bit_0/ila_master_input_volume_width] [get_bd_pins ila_1/probe18]
connect_bd_net [get_bd_pins Convolution_Layer_32bit_0/ila_master_input_volume_channels] [get_bd_pins ila_1/probe19]
connect_bd_net [get_bd_pins Convolution_Layer_32bit_0/ila_master_output_volume_height] [get_bd_pins ila_1/probe20]
connect_bd_net [get_bd_pins Convolution_Layer_32bit_0/ila_master_output_volume_width] [get_bd_pins ila_1/probe21]
connect_bd_net [get_bd_pins Convolution_Layer_32bit_0/ila_master_output_volume_channels] [get_bd_pins ila_1/probe22]
connect_bd_net [get_bd_pins Convolution_Layer_32bit_0/ila_master_weight_filter_height] [get_bd_pins ila_1/probe23]
connect_bd_net [get_bd_pins Convolution_Layer_32bit_0/ila_master_weight_filter_width] [get_bd_pins ila_1/probe24]
connect_bd_net [get_bd_pins Convolution_Layer_32bit_0/ila_master_weight_filter_channels] [get_bd_pins ila_1/probe25]
connect_bd_net [get_bd_pins Convolution_Layer_32bit_0/ila_master_number_of_filters] [get_bd_pins ila_1/probe26]
connect_bd_net [get_bd_pins Convolution_Layer_32bit_0/ila_master_stride] [get_bd_pins ila_1/probe27]
connect_bd_net [get_bd_pins Convolution_Layer_32bit_0/ila_master_pad] [get_bd_pins ila_1/probe28]
connect_bd_net [get_bd_pins Convolution_Layer_32bit_0/ila_master_bias_length] [get_bd_pins ila_1/probe29]
connect_bd_net [get_bd_pins Convolution_Layer_32bit_0/ila_master_ch_al_filt] [get_bd_pins ila_1/probe30]
connect_bd_net [get_bd_pins Convolution_Layer_32bit_0/ila_master_affine_channels_in_set] [get_bd_pins ila_1/probe31]
connect_bd_net [get_bd_pins Convolution_Layer_32bit_0/ila_master_affine_filters_in_set] [get_bd_pins ila_1/probe32]
connect_bd_net [get_bd_pins Convolution_Layer_32bit_0/ila_master_channels_iterations] [get_bd_pins ila_1/probe33]
connect_bd_net [get_bd_pins Convolution_Layer_32bit_0/ila_master_affine_filters_iterations] [get_bd_pins ila_1/probe34]
connect_bd_net [get_bd_pins Convolution_Layer_32bit_0/ila_master_start] [get_bd_pins ila_1/probe35]
connect_bd_net [get_bd_pins Convolution_Layer_32bit_0/ila_volume_fifo_almost_empty] [get_bd_pins ila_2/probe0]
connect_bd_net [get_bd_pins Convolution_Layer_32bit_0/ila_volume_fifo_almost_full] [get_bd_pins ila_2/probe1]
connect_bd_net [get_bd_pins Convolution_Layer_32bit_0/ila_volume_fifo_empty] [get_bd_pins ila_2/probe2]
connect_bd_net [get_bd_pins Convolution_Layer_32bit_0/ila_volume_fifo_full] [get_bd_pins ila_2/probe3]
connect_bd_net [get_bd_pins Convolution_Layer_32bit_0/ila_volume_fifo_rd_en] [get_bd_pins ila_2/probe4]
connect_bd_net [get_bd_pins Convolution_Layer_32bit_0/ila_volume_fifo_valid] [get_bd_pins ila_2/probe5]
connect_bd_net [get_bd_pins Convolution_Layer_32bit_0/ila_volume_fifo_wr_en] [get_bd_pins ila_2/probe6]
connect_bd_net [get_bd_pins Convolution_Layer_32bit_0/ila_weight_fifo_almost_full] [get_bd_pins ila_2/probe7]
connect_bd_net [get_bd_pins Convolution_Layer_32bit_0/ila_weight_fifo_full] [get_bd_pins ila_2/probe8]
connect_bd_net [get_bd_pins Convolution_Layer_32bit_0/ila_weight_fifo_wr_en] [get_bd_pins ila_2/probe9]
connect_bd_net [get_bd_pins Convolution_Layer_32bit_0/ila_weight_fifo_empty] [get_bd_pins ila_2/probe10]
connect_bd_net [get_bd_pins Convolution_Layer_32bit_0/ila_weight_fifo_rd_en] [get_bd_pins ila_2/probe11]
connect_bd_net [get_bd_pins Convolution_Layer_32bit_0/ila_weight_fifo_valid] [get_bd_pins ila_2/probe12]
connect_bd_net [get_bd_pins Convolution_Layer_32bit_0/ila_weight_fifo_almost_empty] [get_bd_pins ila_2/probe13]
connect_bd_net [get_bd_pins Convolution_Layer_32bit_0/ila_weight_rst] [get_bd_pins ila_2/probe14]
connect_bd_net [get_bd_pins Convolution_Layer_32bit_0/ila_volume_mux_prev_data_wr_en] [get_bd_pins ila_2/probe15]
connect_bd_net [get_bd_pins Convolution_Layer_32bit_0/ila_volume_mux_new_data_en] [get_bd_pins ila_2/probe16]
connect_bd_net [get_bd_pins Convolution_Layer_32bit_0/ila_volume_mux_prev_data_en] [get_bd_pins ila_2/probe17]
connect_bd_net [get_bd_pins Convolution_Layer_32bit_0/ila_volume_mux_recycled_data_wr_en] [get_bd_pins ila_2/probe18]
connect_bd_net [get_bd_pins Convolution_Layer_32bit_0/ila_volume_mux_recycled_data_en] [get_bd_pins ila_2/probe19]
connect_bd_net [get_bd_pins Convolution_Layer_32bit_0/ila_volume_stack_fifo_wr_en] [get_bd_pins ila_2/probe20]
connect_bd_net [get_bd_pins Convolution_Layer_32bit_0/ila_volume_stack_fifo_almost_full] [get_bd_pins ila_2/probe21]
connect_bd_net [get_bd_pins Convolution_Layer_32bit_0/ila_volume_stack_fifo_full] [get_bd_pins ila_2/probe22]
connect_bd_net [get_bd_pins Convolution_Layer_32bit_0/ila_weight_mux_recycle_filter_data_wr_en] [get_bd_pins ila_2/probe23]
connect_bd_net [get_bd_pins Convolution_Layer_32bit_0/ila_prev_weight_data] [get_bd_pins ila_2/probe24]
connect_bd_net [get_bd_pins Convolution_Layer_32bit_0/ila_weight_mux_new_data_en] [get_bd_pins ila_2/probe25]
connect_bd_net [get_bd_pins Convolution_Layer_32bit_0/ila_weight_mux_prev_data_en] [get_bd_pins ila_2/probe26]
connect_bd_net [get_bd_pins Convolution_Layer_32bit_0/ila_weight_mux_recycled_data_en] [get_bd_pins ila_2/probe27]
connect_bd_net [get_bd_pins Convolution_Layer_32bit_0/ila_weight_mux_almost_full] [get_bd_pins ila_2/probe28]
connect_bd_net [get_bd_pins Convolution_Layer_32bit_0/ila_weight_mux_full] [get_bd_pins ila_2/probe29]
connect_bd_net [get_bd_pins Convolution_Layer_32bit_0/ila_weight_mux_wr_en] [get_bd_pins ila_2/probe30]
connect_bd_net [get_bd_pins Convolution_Layer_32bit_0/ila_weight_mux_prev_data_wr_en] [get_bd_pins ila_2/probe31]
connect_bd_net [get_bd_pins Convolution_Layer_32bit_0/ila_acc_fifo_almost_empty] [get_bd_pins ila_3/probe0]
connect_bd_net [get_bd_pins Convolution_Layer_32bit_0/ila_acc_fifo_almost_full] [get_bd_pins ila_3/probe1]
connect_bd_net [get_bd_pins Convolution_Layer_32bit_0/ila_acc_fifo_empty] [get_bd_pins ila_3/probe2]
connect_bd_net [get_bd_pins Convolution_Layer_32bit_0/ila_acc_fifo_full] [get_bd_pins ila_3/probe3]
connect_bd_net [get_bd_pins Convolution_Layer_32bit_0/ila_acc_fifo_rd_en] [get_bd_pins ila_3/probe4]
connect_bd_net [get_bd_pins Convolution_Layer_32bit_0/ila_acc_fifo_valid] [get_bd_pins ila_3/probe5]
connect_bd_net [get_bd_pins Convolution_Layer_32bit_0/ila_acc_fifo_wr_en] [get_bd_pins ila_3/probe6]
connect_bd_net [get_bd_pins Convolution_Layer_32bit_0/ila_accu_fifo_input] [get_bd_pins ila_3/probe7]
connect_bd_net [get_bd_pins Convolution_Layer_32bit_0/ila_acc_fifo_din] [get_bd_pins ila_3/probe8]
connect_bd_net [get_bd_pins Convolution_Layer_32bit_0/ila_acc_fifo_dout] [get_bd_pins ila_3/probe9]
connect_bd_net [get_bd_pins Convolution_Layer_32bit_0/ila_bias_fifo_almost_empty] [get_bd_pins ila_3/probe10]
connect_bd_net [get_bd_pins Convolution_Layer_32bit_0/ila_bias_fifo_dout] [get_bd_pins ila_3/probe11]
connect_bd_net [get_bd_pins Convolution_Layer_32bit_0/ila_bias_fifo_empty] [get_bd_pins ila_3/probe12]
connect_bd_net [get_bd_pins Convolution_Layer_32bit_0/ila_bias_fifo_full] [get_bd_pins ila_3/probe13]
connect_bd_net [get_bd_pins Convolution_Layer_32bit_0/ila_bias_fifo_almost_full] [get_bd_pins ila_3/probe14]
connect_bd_net [get_bd_pins Convolution_Layer_32bit_0/ila_bias_fifo_rd_en] [get_bd_pins ila_3/probe15]
connect_bd_net [get_bd_pins Convolution_Layer_32bit_0/ila_bias_fifo_valid] [get_bd_pins ila_3/probe16]
connect_bd_net [get_bd_pins Convolution_Layer_32bit_0/ila_bias_fifo_data_return] [get_bd_pins ila_3/probe17]
connect_bd_net [get_bd_pins Convolution_Layer_32bit_0/ila_bias_fifo_data_return_en] [get_bd_pins ila_3/probe18]
connect_bd_net [get_bd_pins Convolution_Layer_32bit_0/ila_bias_fifo_return_wr_en] [get_bd_pins ila_3/probe19]
connect_bd_net [get_bd_pins Convolution_Layer_32bit_0/ila_bias_fifo_din_mux] [get_bd_pins ila_3/probe20]
connect_bd_net [get_bd_pins Convolution_Layer_32bit_0/ila_bias_fifo_wr_en_mux] [get_bd_pins ila_3/probe21]
connect_bd_net [get_bd_pins Convolution_Layer_32bit_0/ila_prev_fifo_almost_empty] [get_bd_pins ila_3/probe22]
connect_bd_net [get_bd_pins Convolution_Layer_32bit_0/ila_prev_fifo_dout] [get_bd_pins ila_3/probe23]
connect_bd_net [get_bd_pins Convolution_Layer_32bit_0/ila_prev_fifo_empty] [get_bd_pins ila_3/probe24]
connect_bd_net [get_bd_pins Convolution_Layer_32bit_0/ila_prev_fifo_rd_en] [get_bd_pins ila_3/probe25]
connect_bd_net [get_bd_pins Convolution_Layer_32bit_0/ila_prev_fifo_valid] [get_bd_pins ila_3/probe26]
connect_bd_net [get_bd_pins Convolution_Layer_32bit_0/ila_reset] [get_bd_pins ila_3/probe27]
connect_bd_net [get_bd_pins Convolution_Layer_32bit_0/ila_reset_weight_fifo_n] [get_bd_pins ila_3/probe28]
connect_bd_net [get_bd_pins Convolution_Layer_32bit_0/ila_inbuff_din] [get_bd_pins ila_3/probe29]
connect_bd_net [get_bd_pins Convolution_Layer_32bit_0/ila_inbuff_dout] [get_bd_pins ila_3/probe30]
connect_bd_net [get_bd_pins Convolution_Layer_32bit_0/ila_inbuff_almost_empty] [get_bd_pins ila_3/probe31]
connect_bd_net [get_bd_pins Convolution_Layer_32bit_0/ila_inbuff_almost_full] [get_bd_pins ila_3/probe32]
connect_bd_net [get_bd_pins Convolution_Layer_32bit_0/ila_inbuff_empty] [get_bd_pins ila_3/probe33]
connect_bd_net [get_bd_pins Convolution_Layer_32bit_0/ila_inbuff_full] [get_bd_pins ila_3/probe34]
connect_bd_net [get_bd_pins Convolution_Layer_32bit_0/ila_inbuff_rd_en] [get_bd_pins ila_3/probe35]
connect_bd_net [get_bd_pins Convolution_Layer_32bit_0/ila_inbuff_valid] [get_bd_pins ila_3/probe36]
connect_bd_net [get_bd_pins Convolution_Layer_32bit_0/ila_outbuff_almost_empty] [get_bd_pins ila_3/probe37]
connect_bd_net [get_bd_pins Convolution_Layer_32bit_0/ila_outbuff_almost_full] [get_bd_pins ila_3/probe38]
connect_bd_net [get_bd_pins Convolution_Layer_32bit_0/ila_outbuff_empty] [get_bd_pins ila_3/probe39]
connect_bd_net [get_bd_pins Convolution_Layer_32bit_0/ila_outbuff_full] [get_bd_pins ila_3/probe40]
connect_bd_net [get_bd_pins Convolution_Layer_32bit_0/ila_outbuff_valid] [get_bd_pins ila_3/probe41]
connect_bd_net [get_bd_pins Convolution_Layer_32bit_0/ila_outbuff_wr_en] [get_bd_pins ila_3/probe42]
connect_bd_net [get_bd_pins Convolution_Layer_32bit_0/ila_outbuff_din] [get_bd_pins ila_3/probe43]
connect_bd_net [get_bd_pins Convolution_Layer_32bit_0/ila_outbuff_dout] [get_bd_pins ila_3/probe44]
connect_bd_net [get_bd_pins Convolution_Layer_32bit_0/ila_router_disable_channel_n] [get_bd_pins ila_2/probe32]
connect_bd_net [get_bd_pins Convolution_Layer_32bit_0/ila_router_convolution_en] [get_bd_pins ila_2/probe33]
connect_bd_net [get_bd_pins Convolution_Layer_32bit_0/ila_router_affine_en] [get_bd_pins ila_2/probe34]
connect_bd_net [get_bd_pins Convolution_Layer_32bit_0/ila_router_acc_ready] [get_bd_pins ila_2/probe35]
connect_bd_net [get_bd_pins Convolution_Layer_32bit_0/ila_router_filter_kernal_loaded] [get_bd_pins ila_2/probe36]
connect_bd_net [get_bd_pins Convolution_Layer_32bit_0/ila_router_conv_complete] [get_bd_pins ila_2/probe37]
connect_bd_net [get_bd_pins Convolution_Layer_32bit_0/ila_router_affine_complete] [get_bd_pins ila_2/probe38]
connect_bd_net [get_bd_pins Convolution_Layer_32bit_0/ila_router_volume_ready] [get_bd_pins ila_2/probe39]
connect_bd_net [get_bd_pins Convolution_Layer_32bit_0/ila_volume_router_ready] [get_bd_pins ila_2/probe40]
connect_bd_net [get_bd_pins Convolution_Layer_32bit_0/ila_volume_router_padded_volume_size] [get_bd_pins ila_2/probe41]
connect_bd_net [get_bd_pins Convolution_Layer_32bit_0/ila_volume_router_empty_done] [get_bd_pins ila_2/probe42]
connect_bd_net [get_bd_pins Convolution_Layer_32bit_0/ila_volume_router_stop_stack_en] [get_bd_pins ila_2/probe43]
connect_bd_net [get_bd_pins Convolution_Layer_32bit_0/ila_volume_router_calc_params] [get_bd_pins ila_2/probe44]
connect_bd_net [get_bd_pins Convolution_Layer_32bit_0/ila_volume_router_data_return_wr_en] [get_bd_pins ila_2/probe45]
connect_bd_net [get_bd_pins Convolution_Layer_32bit_0/ila_volume_router_data_valid] [get_bd_pins ila_2/probe46]
connect_bd_net [get_bd_pins Convolution_Layer_32bit_0/ila_volume_router_loaded_rows_processed] [get_bd_pins ila_2/probe47]
connect_bd_net [get_bd_pins Convolution_Layer_32bit_0/ila_volume_router_snake_fill_complete] [get_bd_pins ila_2/probe48]
connect_bd_net [get_bd_pins Convolution_Layer_32bit_0/ila_volume_router_empty_data_en] [get_bd_pins ila_2/probe49]
connect_bd_net [get_bd_pins Convolution_Layer_32bit_0/ila_volume_router_empty_data_complete] [get_bd_pins ila_2/probe50]
connect_bd_net [get_bd_pins Convolution_Layer_32bit_0/ila_volume_router_element_counter] [get_bd_pins ila_2/probe51]
connect_bd_net [get_bd_pins Convolution_Layer_32bit_0/ila_volume_router_filter_counter] [get_bd_pins ila_2/probe52]
connect_bd_net [get_bd_pins Convolution_Layer_32bit_0/ila_volume_router_column_counter] [get_bd_pins ila_2/probe53]
connect_bd_net [get_bd_pins Convolution_Layer_32bit_0/ila_volume_router_delay_shift_register] [get_bd_pins ila_2/probe54]
connect_bd_net [get_bd_pins Convolution_Layer_32bit_0/ila_volume_router_pad_16bit] [get_bd_pins ila_2/probe55]
connect_bd_net [get_bd_pins Convolution_Layer_32bit_0/ila_weight_router_ready] [get_bd_pins ila_2/probe56]
connect_bd_net [get_bd_pins Convolution_Layer_32bit_0/ila_weight_router_filter_data_return_wr_en] [get_bd_pins ila_2/probe57]
connect_bd_net [get_bd_pins Convolution_Layer_32bit_0/ila_weight_router_clear_weights] [get_bd_pins ila_2/probe58]
connect_bd_net [get_bd_pins Convolution_Layer_32bit_0/ila_weight_router_data_valid] [get_bd_pins ila_2/probe59]
connect_bd_net [get_bd_pins Convolution_Layer_32bit_0/ila_weight_router_filter_element_counter] [get_bd_pins ila_2/probe60]
connect_bd_net [get_bd_pins Convolution_Layer_32bit_0/ila_weight_router_delay_shift_register] [get_bd_pins ila_2/probe61]
connect_bd_net [get_bd_pins Convolution_Layer_32bit_0/ila_accumulator_state] [get_bd_pins ila_4/probe0]
connect_bd_net [get_bd_pins Convolution_Layer_32bit_0/ila_accumulator_products_array_valid] [get_bd_pins ila_4/probe1]
connect_bd_net [get_bd_pins Convolution_Layer_32bit_0/ila_accumulator_kernel_element_counter] [get_bd_pins ila_4/probe2]
connect_bd_net [get_bd_pins Convolution_Layer_32bit_0/ila_accumulator_delay_shift_register] [get_bd_pins ila_4/probe3]
connect_bd_net [get_bd_pins Convolution_Layer_32bit_0/ila_accumulator_kernel_delay_shift_register] [get_bd_pins ila_4/probe4]
connect_bd_net [get_bd_pins Convolution_Layer_32bit_0/ila_accumulator_acc_ready] [get_bd_pins ila_4/probe5]
connect_bd_net [get_bd_pins Convolution_Layer_32bit_0/ila_accumulator_acc_complete] [get_bd_pins ila_4/probe6]
connect_bd_net [get_bd_pins Convolution_Layer_32bit_0/ila_accumulator_acc_valid] [get_bd_pins ila_4/probe7]
connect_bd_net [get_bd_pins Convolution_Layer_32bit_0/ila_accumulator_acc_data] [get_bd_pins ila_4/probe8]
connect_bd_net [get_bd_pins Convolution_Layer_32bit_0/ila_accumulator_column_counter] [get_bd_pins ila_4/probe9]
connect_bd_net [get_bd_pins Convolution_Layer_32bit_0/ila_accumulator_filter_counter] [get_bd_pins ila_4/probe10]
connect_bd_net [get_bd_pins Convolution_Layer_32bit_0/ila_accumulator_kernel_flag] [get_bd_pins ila_4/probe11]
connect_bd_net [get_bd_pins Convolution_Layer_32bit_0/ila_accumulator_que_acc_data] [get_bd_pins ila_4/probe12]
connect_bd_net [get_bd_pins Convolution_Layer_32bit_0/ila_accumulator_que_acc_valid] [get_bd_pins ila_4/probe13]
connect_bd_net [get_bd_pins Convolution_Layer_32bit_0/ila_accumulator_que_fifo_din] [get_bd_pins ila_4/probe14]
connect_bd_net [get_bd_pins Convolution_Layer_32bit_0/ila_accumulator_que_fifo_wr_en] [get_bd_pins ila_4/probe15]
connect_bd_net [get_bd_pins Convolution_Layer_32bit_0/ila_accumulator_que_fifo_rd_en] [get_bd_pins ila_4/probe16]
connect_bd_net [get_bd_pins Convolution_Layer_32bit_0/ila_accumulator_que_fifo_dout] [get_bd_pins ila_4/probe17]
connect_bd_net [get_bd_pins Convolution_Layer_32bit_0/ila_accumulator_que_fifo_full] [get_bd_pins ila_4/probe18]
connect_bd_net [get_bd_pins Convolution_Layer_32bit_0/ila_accumulator_que_fifo_almost_full] [get_bd_pins ila_4/probe19]
connect_bd_net [get_bd_pins Convolution_Layer_32bit_0/ila_accumulator_que_fifo_empty] [get_bd_pins ila_4/probe20]
connect_bd_net [get_bd_pins Convolution_Layer_32bit_0/ila_accumulator_que_fifo_valid] [get_bd_pins ila_4/probe22]
connect_bd_net [get_bd_pins Convolution_Layer_32bit_0/ila_accumulator_channels_allowed_counter] [get_bd_pins ila_4/probe23]
connect_bd_net [get_bd_pins Convolution_Layer_32bit_0/ila_accumulator_filter_size_counter] [get_bd_pins ila_4/probe24]
connect_bd_net [get_bd_pins Convolution_Layer_32bit_0/ila_accumulator_channels_filt_counter] [get_bd_pins ila_4/probe25]
connect_bd_net [get_bd_pins Convolution_Layer_32bit_0/ila_acc_relay_state] [get_bd_pins ila_4/probe26]
connect_bd_net [get_bd_pins Convolution_Layer_32bit_0/ila_acc_relay_complete] [get_bd_pins ila_4/probe27]
connect_bd_net [get_bd_pins Convolution_Layer_32bit_0/ila_acc_relay_volume_processed] [get_bd_pins ila_4/probe28]
connect_bd_net [get_bd_pins Convolution_Layer_32bit_0/ila_acc_relay_iteration_complete] [get_bd_pins ila_4/probe29]
connect_bd_net [get_bd_pins Convolution_Layer_32bit_0/ila_acc_relay_filter_counter] [get_bd_pins ila_4/probe30]
connect_bd_net [get_bd_pins Convolution_Layer_32bit_0/ila_acc_relay_output_pixel_counter] [get_bd_pins ila_4/probe31]
connect_bd_net [get_bd_pins Convolution_Layer_32bit_0/ila_acc_relay_volume_row_counter] [get_bd_pins ila_4/probe32]
connect_bd_net [get_bd_pins Convolution_Layer_32bit_0/ila_acc_relay_adder_counter] [get_bd_pins ila_4/probe33]
connect_bd_net [get_bd_pins Convolution_Layer_32bit_0/ila_acc_relay_addend] [get_bd_pins ila_4/probe34]
connect_bd_net [get_bd_pins Convolution_Layer_32bit_0/ila_acc_relay_augend] [get_bd_pins ila_4/probe35]
connect_bd_net [get_bd_pins Convolution_Layer_32bit_0/ila_acc_relay_sum_result] [get_bd_pins ila_4/probe36]
connect_bd_net [get_bd_pins Convolution_Layer_32bit_0/ila_acc_relay_first_channel_set_complete] [get_bd_pins ila_4/probe37]
connect_bd_net [get_bd_pins Convolution_Layer_32bit_0/ila_acc_relay_volume_data] [get_bd_pins ila_4/probe38]
connect_bd_net [get_bd_pins Convolution_Layer_32bit_0/ila_acc_relay_bias_data] [get_bd_pins ila_4/probe39]
connect_bd_net [get_bd_pins Convolution_Layer_32bit_0/ila_acc_relay_prev_data] [get_bd_pins ila_4/probe40]
connect_bd_net [get_bd_pins Convolution_Layer_32bit_0/ila_acc_relay_iteration_counter] [get_bd_pins ila_4/probe41]
connect_bd_net [get_bd_pins Convolution_Layer_32bit_0/ila_acc_relay_bias_read] [get_bd_pins ila_4/probe42]
connect_bd_net [get_bd_pins Convolution_Layer_32bit_0/ila_acc_relay_prev_read] [get_bd_pins ila_4/probe43]
connect_bd_net [get_bd_pins Convolution_Layer_32bit_0/ila_acc_relay_filter_iteration_counter] [get_bd_pins ila_4/probe44]
connect_bd_net [get_bd_pins Convolution_Layer_32bit_0/ila_acc_relay_affine_en] [get_bd_pins ila_4/probe45]
connect_bd_net [get_bd_pins Convolution_Layer_32bit_0/ila_get_weight_row] [get_bd_pins ila_5/probe0]
connect_bd_net [get_bd_pins Convolution_Layer_32bit_0/ila_controller_state] [get_bd_pins ila_5/probe1]
connect_bd_net [get_bd_pins Convolution_Layer_32bit_0/ila_controller_filter_iterations_required] [get_bd_pins ila_5/probe2]
connect_bd_net [get_bd_pins Convolution_Layer_32bit_0/ila_controller_filters_in_set] [get_bd_pins ila_5/probe3]
connect_bd_net [get_bd_pins Convolution_Layer_32bit_0/ila_controller_accumulator_en] [get_bd_pins ila_5/probe4]
connect_bd_net [get_bd_pins Convolution_Layer_32bit_0/ila_controller_fifo_clear] [get_bd_pins ila_5/probe5]
connect_bd_net [get_bd_pins Convolution_Layer_32bit_0/ila_controller_fifo_reset] [get_bd_pins ila_5/probe6]
connect_bd_net [get_bd_pins Convolution_Layer_32bit_0/ila_controller_channels_allowed] [get_bd_pins ila_5/probe7]
connect_bd_net [get_bd_pins Convolution_Layer_32bit_0/ila_controller_more_dsps_needed] [get_bd_pins ila_5/probe8]
connect_bd_net [get_bd_pins Convolution_Layer_32bit_0/ila_controller_operation_complete] [get_bd_pins ila_5/probe9]
connect_bd_net [get_bd_pins Convolution_Layer_32bit_0/ila_controller_num_iterations] [get_bd_pins ila_5/probe10]
connect_bd_net [get_bd_pins Convolution_Layer_32bit_0/ila_controller_all_channels_processed] [get_bd_pins ila_5/probe11]
connect_bd_net [get_bd_pins Convolution_Layer_32bit_0/ila_controller_input_volume_row_counter] [get_bd_pins ila_5/probe12]
connect_bd_net [get_bd_pins Convolution_Layer_32bit_0/ila_controller_volume_channel_counter] [get_bd_pins ila_5/probe13]
connect_bd_net [get_bd_pins Convolution_Layer_32bit_0/ila_controller_weight_channel_counter] [get_bd_pins ila_5/probe14]
connect_bd_net [get_bd_pins Convolution_Layer_32bit_0/ila_controller_filter_row_counter] [get_bd_pins ila_5/probe15]
connect_bd_net [get_bd_pins Convolution_Layer_32bit_0/ila_controller_filter_column_counter] [get_bd_pins ila_5/probe16]
connect_bd_net [get_bd_pins Convolution_Layer_32bit_0/ila_controller_filter_counter] [get_bd_pins ila_5/probe17]
connect_bd_net [get_bd_pins Convolution_Layer_32bit_0/ila_controller_volume_row_counter] [get_bd_pins ila_5/probe18]
connect_bd_net [get_bd_pins Convolution_Layer_32bit_0/ila_controller_volume_column_counter] [get_bd_pins ila_5/probe19]
connect_bd_net [get_bd_pins Convolution_Layer_32bit_0/ila_controller_volume_index_counter] [get_bd_pins ila_5/probe20]
connect_bd_net [get_bd_pins Convolution_Layer_32bit_0/ila_controller_weight_index_counter] [get_bd_pins ila_5/probe21]
connect_bd_net [get_bd_pins Convolution_Layer_32bit_0/ila_controller_padded_volume_row_size] [get_bd_pins ila_5/probe22]
connect_bd_net [get_bd_pins Convolution_Layer_32bit_0/ila_controller_padded_volume_column_size] [get_bd_pins ila_5/probe23]
connect_bd_net [get_bd_pins Convolution_Layer_32bit_0/ila_controller_volume_rows_processed] [get_bd_pins ila_5/probe24]
connect_bd_net [get_bd_pins Convolution_Layer_32bit_0/ila_controller_element_counter] [get_bd_pins ila_5/probe25]
connect_bd_net [get_bd_pins Convolution_Layer_32bit_0/ila_controller_pad_counter] [get_bd_pins ila_5/probe26]
connect_bd_net [get_bd_pins Convolution_Layer_32bit_0/ila_controller_channels_processed] [get_bd_pins ila_5/probe27]
connect_bd_net [get_bd_pins Convolution_Layer_32bit_0/ila_controller_pad_8bit] [get_bd_pins ila_5/probe28]
connect_bd_net [get_bd_pins Convolution_Layer_32bit_0/ila_controller_pad_10bit] [get_bd_pins ila_5/probe29]
connect_bd_net [get_bd_pins Convolution_Layer_32bit_0/ila_controller_pad_16bit] [get_bd_pins ila_6/probe0]
connect_bd_net [get_bd_pins Convolution_Layer_32bit_0/ila_controller_input_volume_size_10bit] [get_bd_pins ila_6/probe1]
connect_bd_net [get_bd_pins Convolution_Layer_32bit_0/ila_controller_volume_row] [get_bd_pins ila_6/probe2]
connect_bd_net [get_bd_pins Convolution_Layer_32bit_0/ila_controller_iteration_calc] [get_bd_pins ila_6/probe3]
connect_bd_net [get_bd_pins Convolution_Layer_32bit_0/ila_controller_iteration_counter] [get_bd_pins ila_6/probe4]
connect_bd_net [get_bd_pins Convolution_Layer_32bit_0/ila_controller_filter_iteration_counter] [get_bd_pins ila_6/probe5]
connect_bd_net [get_bd_pins Convolution_Layer_32bit_0/ila_controller_channel_iteration_counter] [get_bd_pins ila_6/probe6]
connect_bd_net [get_bd_pins Convolution_Layer_32bit_0/ila_controller_stride_counter] [get_bd_pins ila_6/probe7]
connect_bd_net [get_bd_pins Convolution_Layer_32bit_0/ila_controller_pad_row_counter] [get_bd_pins ila_6/probe8]
connect_bd_net [get_bd_pins Convolution_Layer_32bit_0/ila_controller_filter_iteration_complete] [get_bd_pins ila_6/probe9]
connect_bd_net [get_bd_pins Convolution_Layer_32bit_0/ila_controller_channel_iteration_complete] [get_bd_pins ila_6/probe10]
connect_bd_net [get_bd_pins Convolution_Layer_32bit_0/ila_controller_fifo_clear_counter] [get_bd_pins ila_6/probe11]
connect_bd_net [get_bd_pins Convolution_Layer_32bit_0/ila_controller_channel_iteration_calc] [get_bd_pins ila_6/probe12]
connect_bd_net [get_bd_pins Convolution_Layer_32bit_0/ila_controller_channel_iterations_required] [get_bd_pins ila_6/probe13]
connect_bd_net [get_bd_pins Convolution_Layer_32bit_0/ila_controller_filter_iteration_calc] [get_bd_pins ila_6/probe14]
connect_bd_net [get_bd_pins Convolution_Layer_32bit_0/ila_controller_channel_mask] [get_bd_pins ila_6/probe15]
connect_bd_net [get_bd_pins Convolution_Layer_32bit_0/ila_controller_weight_filter_size] [get_bd_pins ila_6/probe16]
connect_bd_net [get_bd_pins Convolution_Layer_32bit_0/ila_controller_input_volume_size] [get_bd_pins ila_6/probe17]
connect_bd_net [get_bd_pins Convolution_Layer_32bit_0/ila_controller_input_volume_channels] [get_bd_pins ila_6/probe18]
connect_bd_net [get_bd_pins Convolution_Layer_32bit_0/ila_controller_weight_filter_channels] [get_bd_pins ila_6/probe19]
connect_bd_net [get_bd_pins Convolution_Layer_32bit_0/ila_controller_number_of_filters] [get_bd_pins ila_6/probe20]
connect_bd_net [get_bd_pins Convolution_Layer_32bit_0/ila_controller_channels_in_set] [get_bd_pins ila_6/probe21]
connect_bd_net [get_bd_pins Convolution_Layer_32bit_0/ila_controller_stride_index] [get_bd_pins ila_6/probe22]
connect_bd_net [get_bd_pins Convolution_Layer_32bit_0/ila_controller_empty_data_complete] [get_bd_pins ila_6/probe23]
connect_bd_net [get_bd_pins Convolution_Layer_32bit_0/o_cycle] \
  [get_bd_pins ila_0/probe42] [get_bd_pins ila_2/probe62] [get_bd_pins ila_4/probe46] [get_bd_pins ila_3/probe45] \
  [get_bd_pins ila_5/probe30] [get_bd_pins ila_6/probe24] [get_bd_pins ila_1/probe36]
connect_bd_net [get_bd_pins Convolution_Layer_32bit_0/o_epoch] \
  [get_bd_pins ila_0/probe63] [get_bd_pins ila_2/probe63] [get_bd_pins ila_4/probe47] [get_bd_pins ila_3/probe46] \
  [get_bd_pins ila_5/probe31] [get_bd_pins ila_6/probe25] [get_bd_pins ila_1/probe37]
connect_bd_net [get_bd_pins Convolution_Layer_32bit_0/ila_accumulator_que_fifo_almost_empty] [get_bd_pins ila_4/probe21]
connect_bd_net [get_bd_pins Convolution_Layer_32bit_0/ila_weight_router_state] [get_bd_pins ila_5/probe32]
connect_bd_net [get_bd_pins Convolution_Layer_32bit_0/ila_volume_router_state] [get_bd_pins ila_5/probe33]
connect_bd_net [get_bd_ports i_test_number] [get_bd_pins Convolution_Tester_0/i_test_number]

# ---- address map ----
assign_bd_address -offset 0x80000000 -range 512M -target_address_space [get_bd_addr_spaces Convolution_Layer_32bit_0/M00_AXI] [get_bd_addr_segs mig_7series_0/memmap/memaddr]
assign_bd_address -offset 0x44A00000 -range 64K -target_address_space [get_bd_addr_spaces Convolution_Tester_0/M00_AXI] [get_bd_addr_segs Convolution_Layer_32bit_0/S00_AXI/S00_AXI_reg]

validate_bd_design
save_bd_design
